# EAGLE design pwr schema (EAGLE 9.6.2)
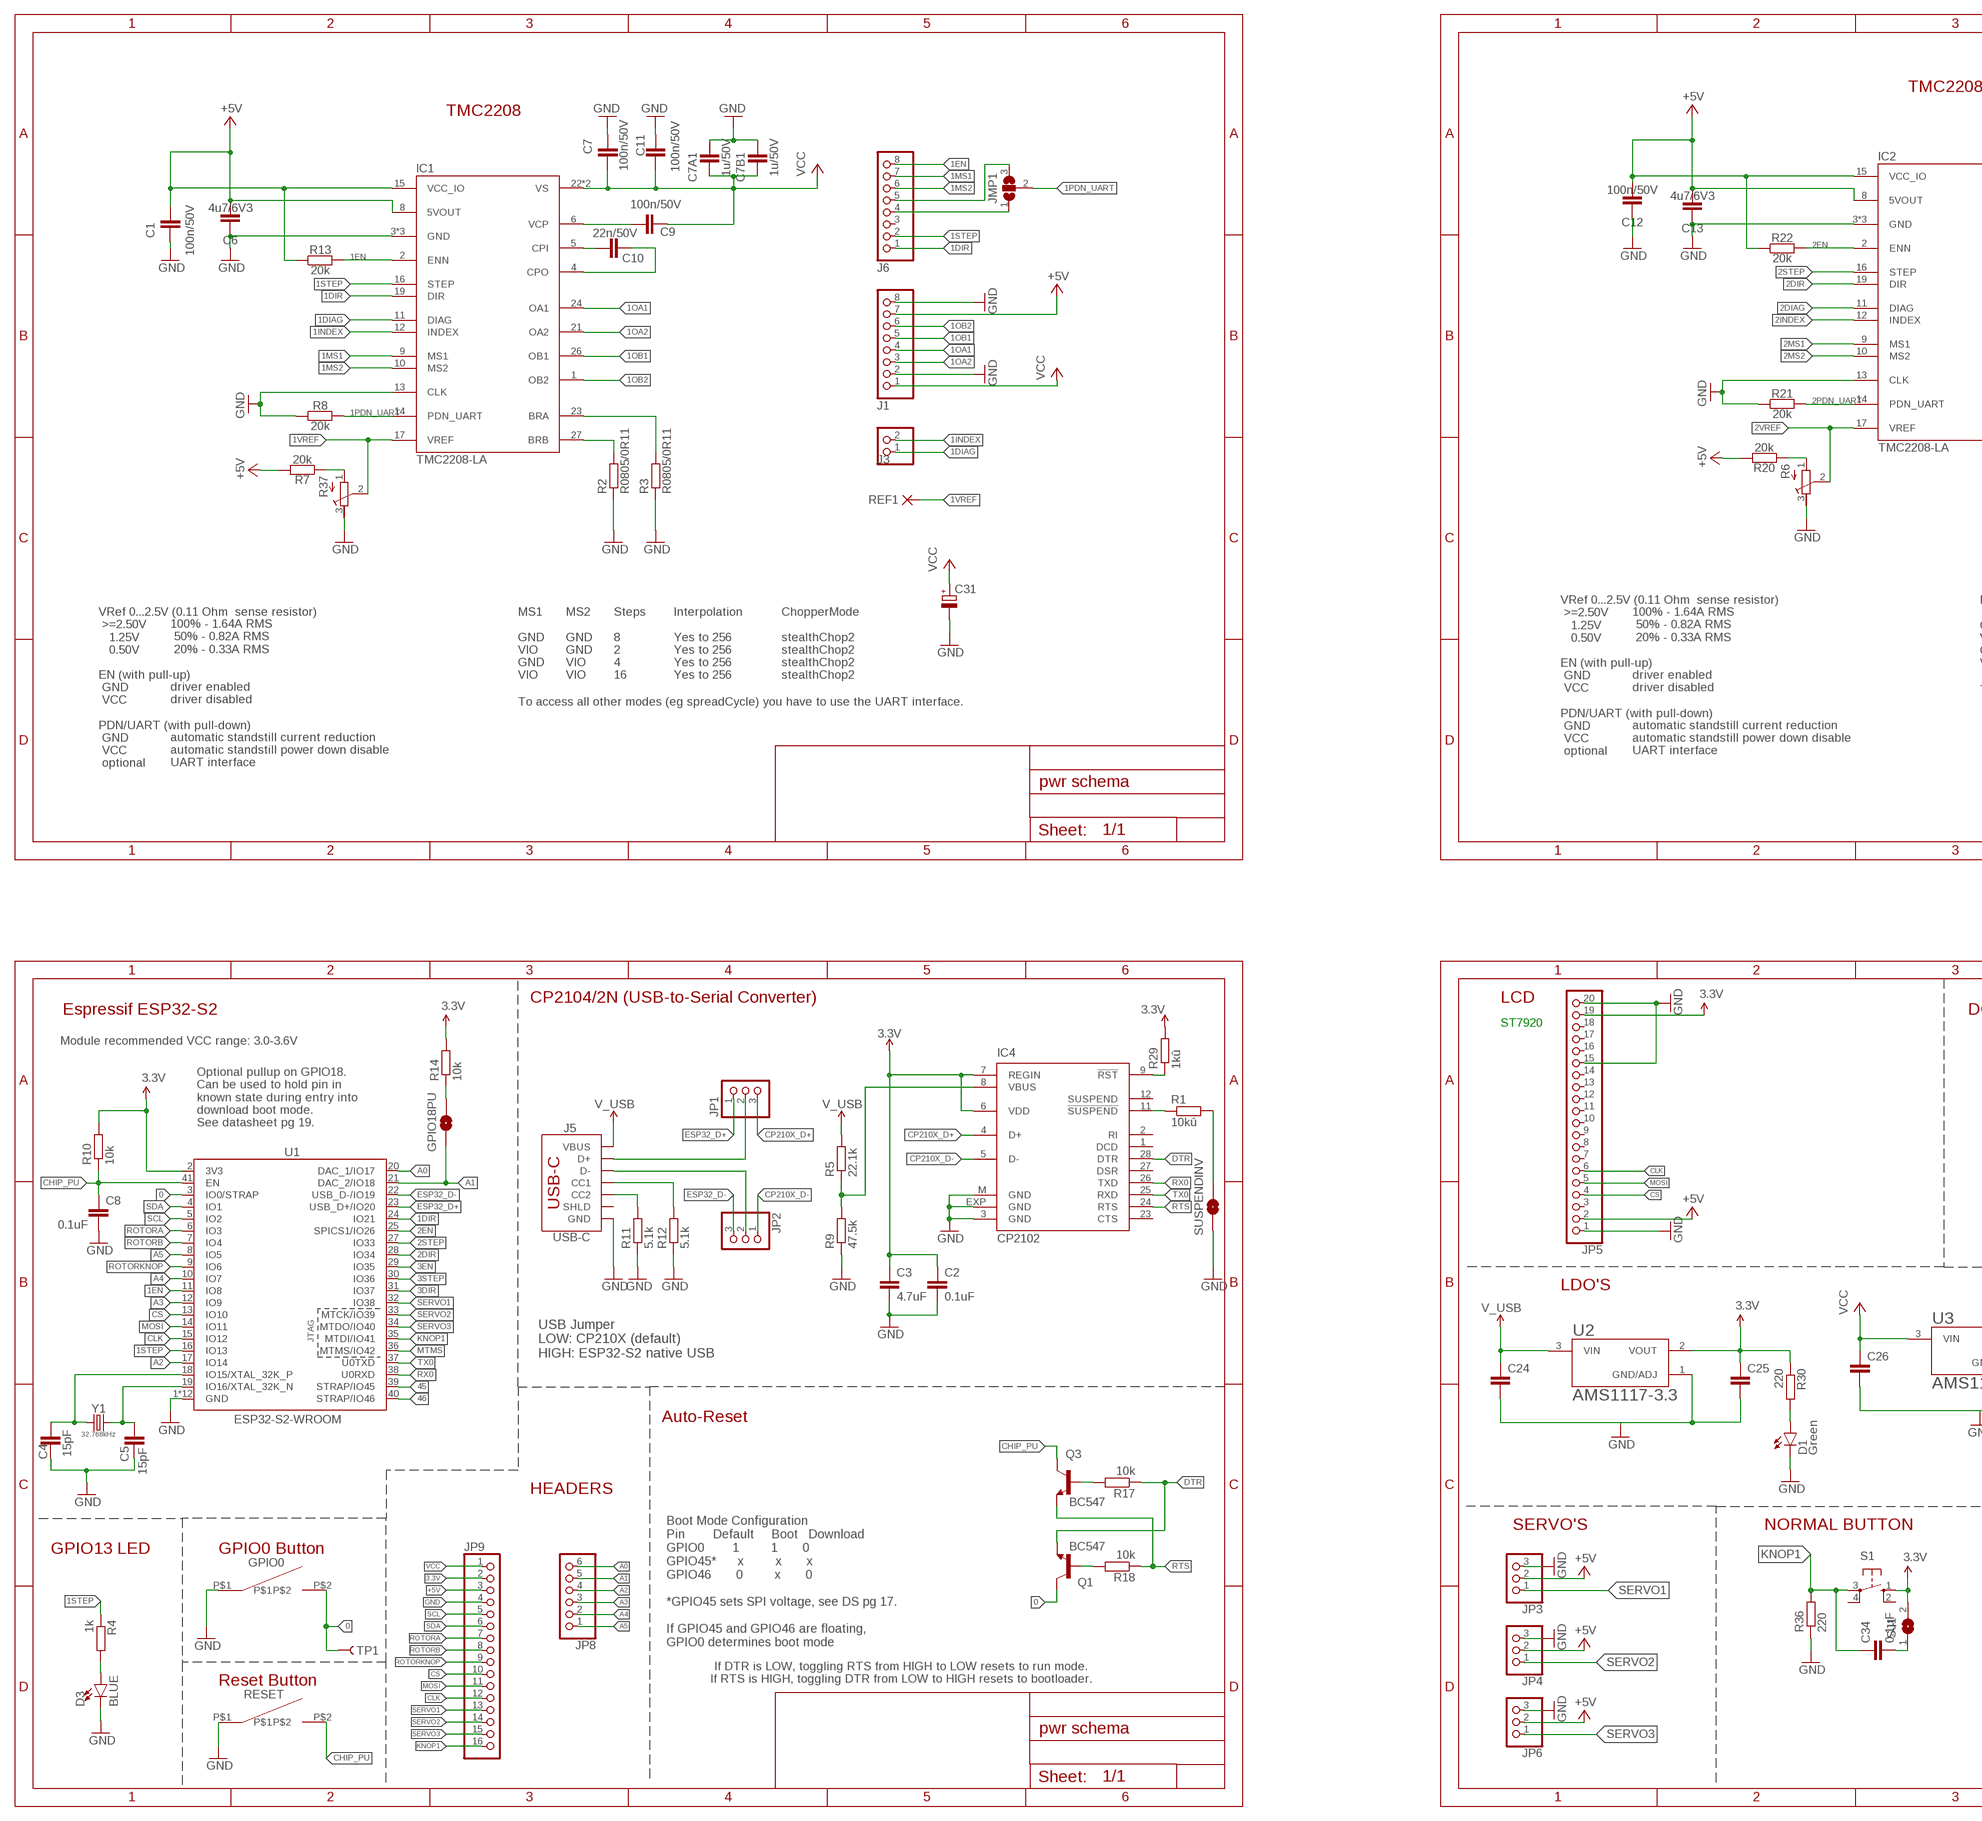
[diagram p0: schematic, sheet 1, part 1 of 2]
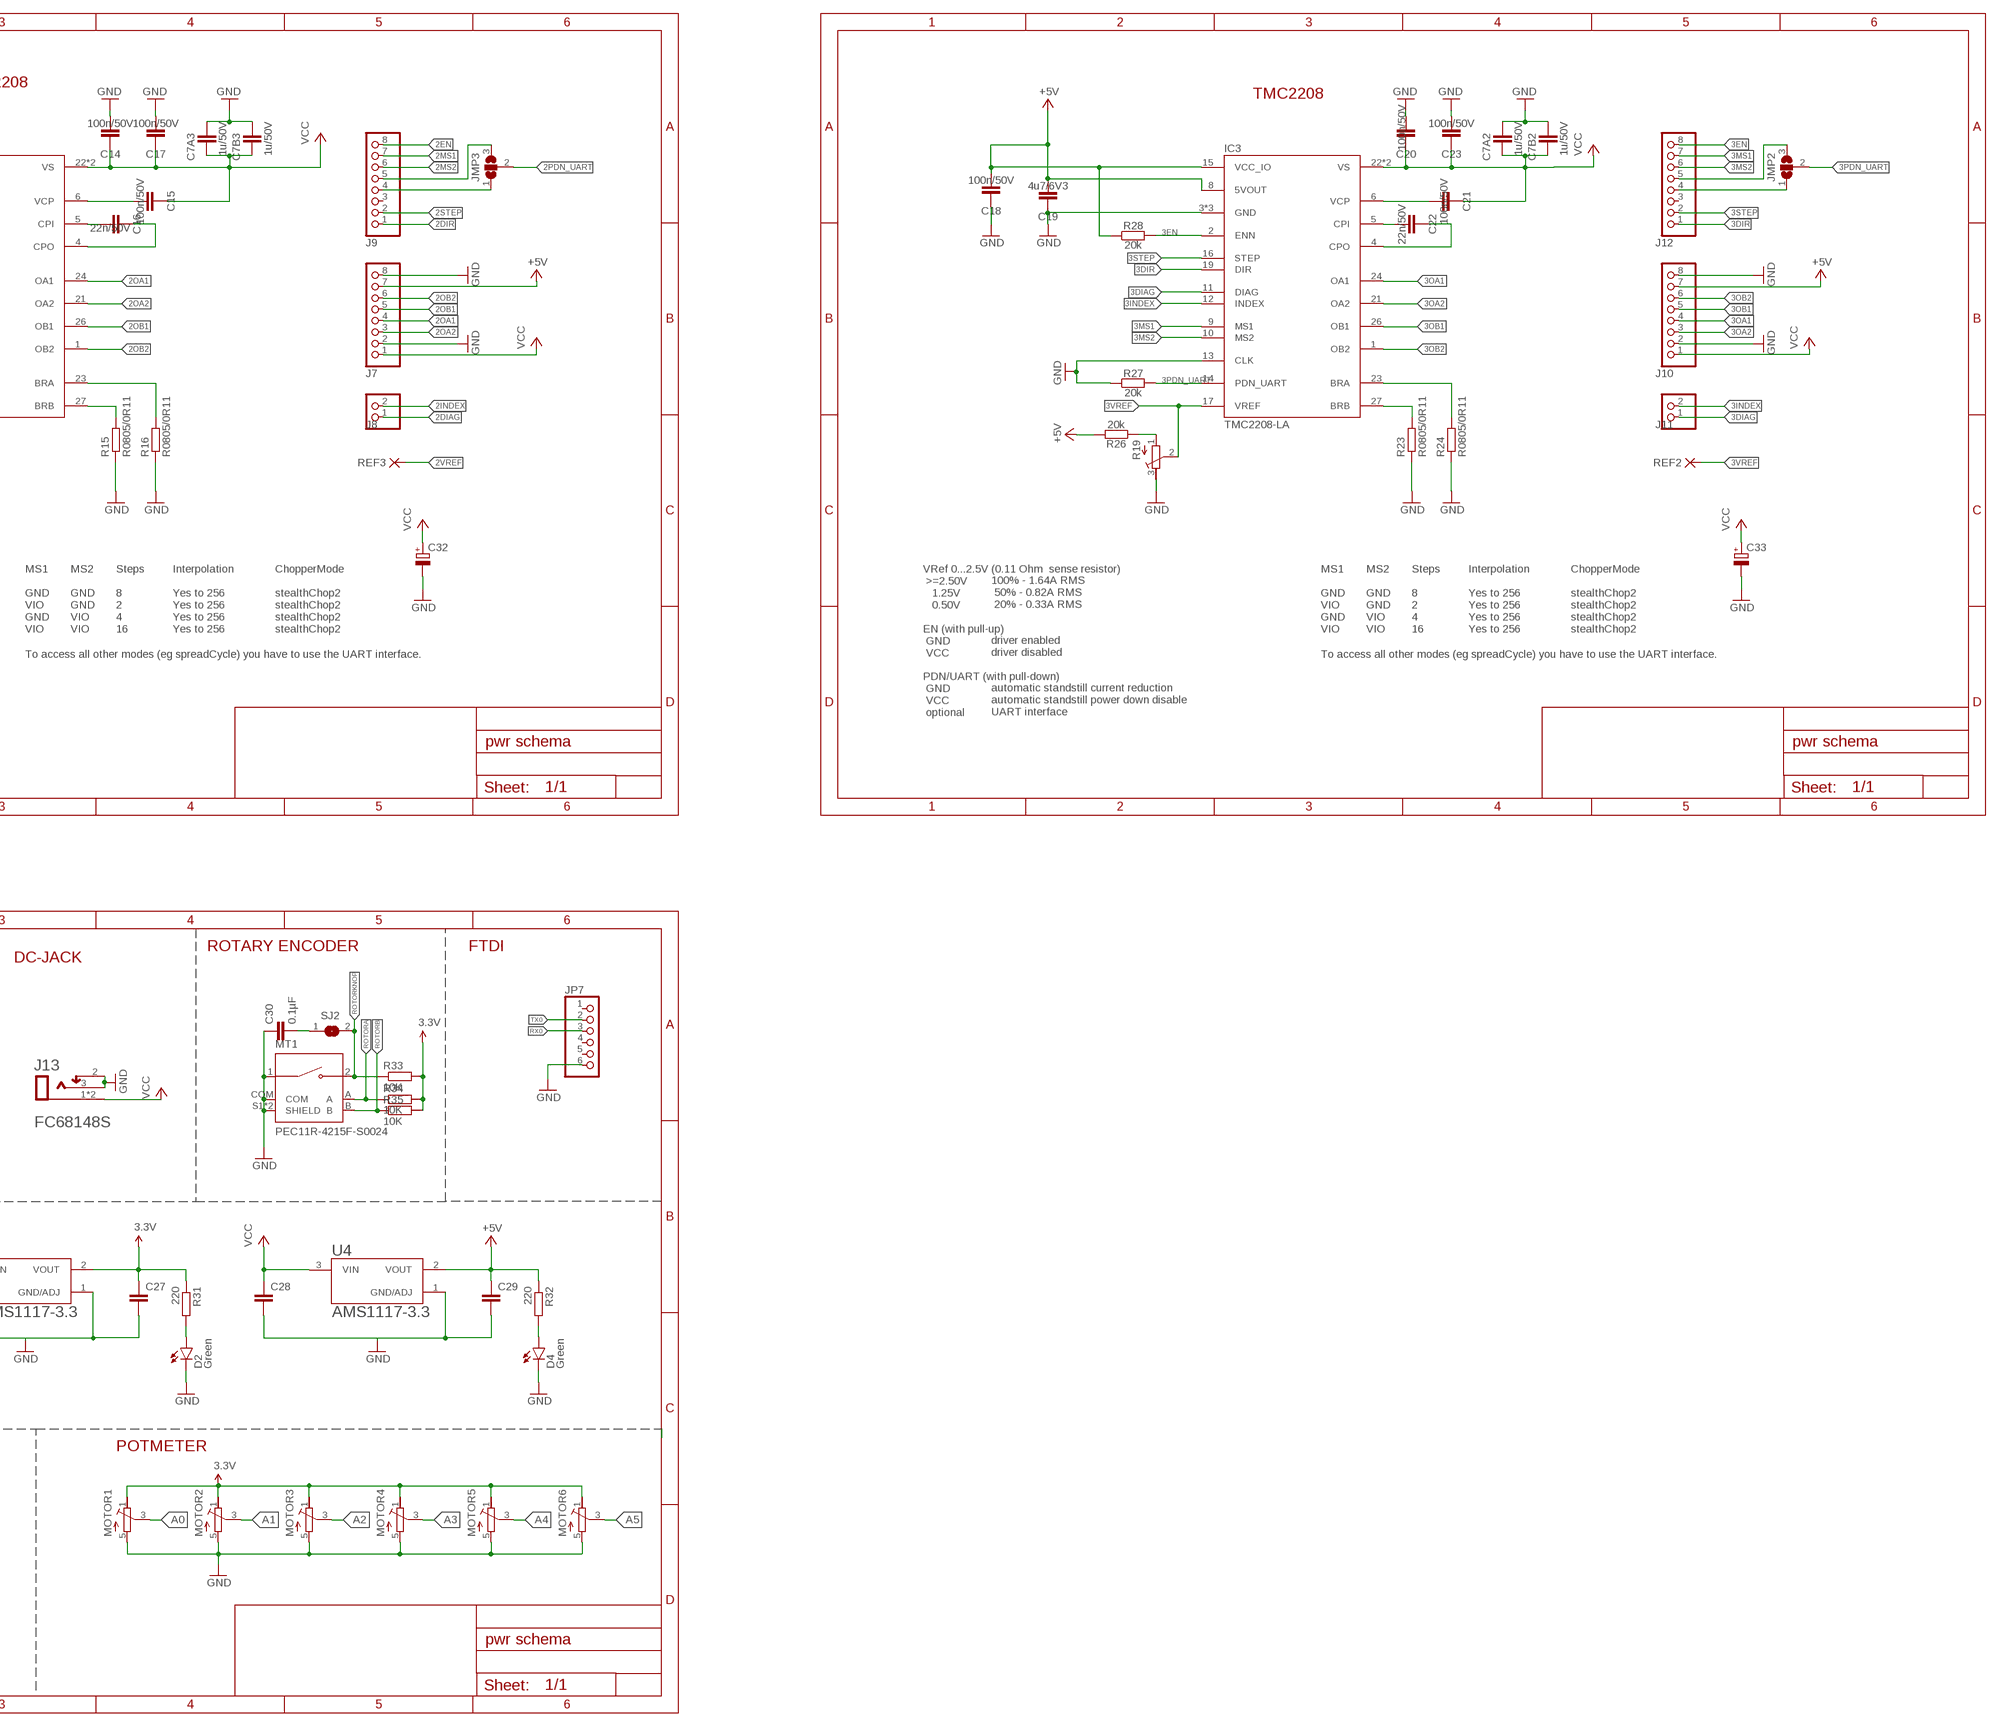
[diagram p1: schematic, sheet 1, part 2 of 2]

## Parts
C1  100n/50V  C-EUC1206  [C1206]
C2  0.1uF  C-EUC1206  [C1206]
C3  4.7uF  C-EUC1206  [C1206]
C4  15pF  C-EUC1206  [C1206]
C5  15pF  C-EUC1206  [C1206]
C6  4u7/6V3  C-EUC1206  [C1206]
C7  100n/50V  C-EUC1206  [C1206]
C7A1  1u/50V  C-EUC1206  [C1206]
C7A2  1u/50V  C-EUC1206  [C1206]
C7A3  1u/50V  C-EUC1206  [C1206]
C7B1  1u/50V  C-EUC1206  [C1206]
C7B2  1u/50V  C-EUC1206  [C1206]
C7B3  1u/50V  C-EUC1206  [C1206]
C8  0.1uF  C-EUC1206  [C1206]
C9  100n/50V  C-EUC1206  [C1206]
C10  22n/50V  C-EUC1206  [C1206]
C11  100n/50V  C-EUC1206  [C1206]
C12  100n/50V  C-EUC1206  [C1206]
C13  4u7/6V3  C-EUC1206  [C1206]
C14  100n/50V  C-EUC1206  [C1206]
C15  100n/50V  C-EUC1206  [C1206]
C16  22n/50V  C-EUC1206  [C1206]
C17  100n/50V  C-EUC1206  [C1206]
C18  100n/50V  C-EUC1206  [C1206]
C19  4u7/6V3  C-EUC1206  [C1206]
C20  100n/50V  C-EUC1206  [C1206]
C21  100n/50V  C-EUC1206  [C1206]
C22  22n/50V  C-EUC1206  [C1206]
C23  100n/50V  C-EUC1206  [C1206]
C24  C-EUC1206  [C1206]
C25  C-EUC1206  [C1206]
C26  C-EUC1206  [C1206]
C27  C-EUC1206  [C1206]
C28  C-EUC1206  [C1206]
C29  C-EUC1206  [C1206]
C30  0.1µF  C-EUC1206  [C1206]
C31  CPOL-EUE2.5-6  [E2,5-6]
C32  CPOL-EUE2.5-6  [E2,5-6]
C33  CPOL-EUE2.5-6  [E2,5-6]
C34  0.1µF  C-EUC1206  [C1206]
D1  Green  LEDCHIP-LED0603  [CHIP-LED0603]
D2  Green  LEDCHIP-LED0603  [CHIP-LED0603]
D3  BLUE  LED-BLUE0603  [LED-0603]
D4  Green  LEDCHIP-LED0603  [CHIP-LED0603]
GPIO0  SWITCHSMD3X6MM  [SWITCHSMD3X6MM]
GPIO18PU  JUMPER-SMT_2_NO_SILK  [SMT-JUMPER_2_NO_SILK]
IC1  TMC2208-LA  [QFN28-PAD]
IC2  TMC2208-LA  [QFN28-PAD]
IC3  TMC2208-LA  [QFN28-PAD]
IC4  CP2102  [MLP28]
J1  PINHD-1X8  [1X08]
J3  PINHD-1X2  [1X02]
J5  USB-C  USB_C_4-LAYER-ISOLATED  [USB-C-16P-4LAYER-ISOLATED]
J6  PINHD-1X8  [1X08]
J7  PINHD-1X8  [1X08]
J8  PINHD-1X2  [1X02]
J9  PINHD-1X8  [1X08]
J10  PINHD-1X8  [1X08]
J11  PINHD-1X2  [1X02]
J12  PINHD-1X8  [1X08]
J13  CLIFF_FC68148SCLIFF_FC68148S_0_0  [CLIFF_FC68148S_0]
JMP1  JUMPER3-0402-NC  [JUMPER3-0402_NC]
JMP2  JUMPER3-0402-NC  [JUMPER3-0402_NC]
JMP3  JUMPER3-0402-NC  [JUMPER3-0402_NC]
JP1  PINHD-1X3  [1X03]
JP2  PINHD-1X3  [1X03]
JP3  PINHD-1X3  [1X03]
JP4  PINHD-1X3  [1X03]
JP5  PINHD-1X20  [1X20]
JP6  PINHD-1X3  [1X03]
JP7  PINHD-1X6  [1X06]
JP8  PINHD-1X6  [1X06]
JP9  PINHD-1X16  [1X16]
MOTOR1  POTMETER  [POTMETER]
MOTOR2  POTMETER  [POTMETER]
MOTOR3  POTMETER  [POTMETER]
MOTOR4  POTMETER  [POTMETER]
MOTOR5  POTMETER  [POTMETER]
MOTOR6  POTMETER  [POTMETER]
MT1  PEC11R-4215F-S0024  [XDCR_PEC11R-4215F-S0024]
Q1  BC547  [TO92]
Q3  BC547  [TO92]
R1  10kû  R-EU_R1206  [R1206]
R2  R0805/0R11  R-EU_R1206  [R1206]
R3  R0805/0R11  R-EU_R1206  [R1206]
R4  1k  R-EU_R1206  [R1206]
R5  22.1k  R-EU_R1206  [R1206]
R6  R-TRIMM3103  [RTRIM3103]
R7  20k  R-EU_R1206  [R1206]
R8  20k  R-EU_R1206  [R1206]
R9  47.5k  R-EU_R1206  [R1206]
R10  10k  R-EU_R1206  [R1206]
R11  5.1k  R-EU_R1206  [R1206]
R12  5.1k  R-EU_R1206  [R1206]
R13  20k  R-EU_R1206  [R1206]
R14  10k  R-EU_R1206  [R1206]
R15  R0805/0R11  R-EU_R1206  [R1206]
R16  R0805/0R11  R-EU_R1206  [R1206]
R17  10k  R-EU_R1206  [R1206]
R18  10k  R-EU_R1206  [R1206]
R19  R-TRIMM3103  [RTRIM3103]
R20  20k  R-EU_R1206  [R1206]
R21  20k  R-EU_R1206  [R1206]
R22  20k  R-EU_R1206  [R1206]
R23  R0805/0R11  R-EU_R1206  [R1206]
R24  R0805/0R11  R-EU_R1206  [R1206]
R26  20k  R-EU_R1206  [R1206]
R27  20k  R-EU_R1206  [R1206]
R28  20k  R-EU_R1206  [R1206]
R29  1kû  R-EU_R1206  [R1206]
R30  220  R-EU_R1206  [R1206]
R31  220  R-EU_R1206  [R1206]
R32  220  R-EU_R1206  [R1206]
R33  10K  R-EU_R1206  [R1206]
R34  10K  R-EU_R1206  [R1206]
R35  10K  R-EU_R1206  [R1206]
R36  220  R-EU_R1206  [R1206]
R37  R-TRIMM3103  [RTRIM3103]
REF1  PAD-0.6-1.1  [PAD-0.6-1.1]
REF2  PAD-0.6-1.1  [PAD-0.6-1.1]
REF3  PAD-0.6-1.1  [PAD-0.6-1.1]
RESET  SWITCHSMD3X6MM  [SWITCHSMD3X6MM]
S1  10-XX  [B3F-10XX]
SJ1  SJ  [SJ]
SJ2  SJ  [SJ]
SUSPENDINV  JUMPER-SMT_2_NO_SILK  [SMT-JUMPER_2_NO_SILK]
TP1  TEST-POINTTP_15TH_THRU  [TP_15TH]
U1  ESP32-S2-WROOM  [ESP32-S2-WROOM]
U2  AMS1117-3.3  [SOT229P700X180-4N]
U3  AMS1117-3.3  [SOT229P700X180-4N]
U4  AMS1117-3.3  [SOT229P700X180-4N]
Y1  32.768kHz  CRYSTAL-32.768KHZSMD-3.2X1.5  [CRYSTAL-SMD-3.2X1.5MM]

## Nets
0: GPIO0.P$2 Q1.3(C) TP1.P$1 U1.3(IO0/STRAP)
1BRA: IC1.23(BRA) R3.2
1BRB: IC1.27(BRB) R2.2
1CPI: C10.2 IC1.5(CPI)
1CPO: C10.1 IC1.4(CPO)
1DIAG: IC1.11(DIAG) J3.1
1DIR: IC1.19(DIR) J6.1 U1.24(IO21)
1EN: IC1.2(ENN) J6.8 R13.2 U1.11(IO8)
1INDEX: IC1.12(INDEX) J3.2
1MS1: IC1.9(MS1) J6.7
1MS2: IC1.10(MS2) J6.6
1OA1: IC1.24(OA1) J1.4
1OA2: IC1.21(OA2) J1.3
1OB1: IC1.26(OB1) J1.5
1OB2: IC1.1(OB2) J1.6
1PDN_UART: IC1.14(PDN_UART) JMP1.2 R8.2
1STEP: IC1.16(STEP) J6.2 R4.1 U1.16(IO13)
1VCP: C9.2 IC1.6(VCP)
1VREF: IC1.17(VREF) R37.2(S) REF1.1(P)
1VREF1: R7.1 R37.1(A)
2BRA: IC2.23(BRA) R16.2
2BRB: IC2.27(BRB) R15.2
2CPI: C16.2 IC2.5(CPI)
2CPO: C16.1 IC2.4(CPO)
2DIAG: IC2.11(DIAG) J8.1
2DIR: IC2.19(DIR) J9.1 U1.28(IO34)
2EN: IC2.2(ENN) J9.8 R22.2 U1.25(SPICS1/IO26)
2INDEX: IC2.12(INDEX) J8.2
2MS1: IC2.9(MS1) J9.7
2MS2: IC2.10(MS2) J9.6
2OA1: IC2.24(OA1) J7.4
2OA2: IC2.21(OA2) J7.3
2OB1: IC2.26(OB1) J7.5
2OB2: IC2.1(OB2) J7.6
2PDN_UART: IC2.14(PDN_UART) JMP3.2 R21.2
2STEP: IC2.16(STEP) J9.2 U1.27(IO33)
2VCP: C15.2 IC2.6(VCP)
2VREF: IC2.17(VREF) R6.2(S) REF3.1(P)
2VREF1: R6.1(A) R20.1
3.3V: C2.1 C3.1 C25.1 C27.1 IC4.6(VDD) IC4.7(REGIN) JP5.19 JP9.2 MOTOR1.1(E) MOTOR2.1(E) MOTOR3.1(E) MOTOR4.1(E) MOTOR5.1(E) MOTOR6.1(E) R10.2 R14.2 R29.2 R30.1 R31.1 R33.2 R34.2 R35.2 S1.1(S) SJ1.2 U1.2(3V3) U2.2(VOUT) U3.2(VOUT)
3BRA: IC3.23(BRA) R24.2
3BRB: IC3.27(BRB) R23.2
3CPI: C22.2 IC3.5(CPI)
3CPO: C22.1 IC3.4(CPO)
3DIAG: IC3.11(DIAG) J11.1
3DIR: IC3.19(DIR) J12.1 U1.31(IO37)
3EN: IC3.2(ENN) J12.8 R28.2 U1.29(IO35)
3INDEX: IC3.12(INDEX) J11.2
3MS1: IC3.9(MS1) J12.7
3MS2: IC3.10(MS2) J12.6
3OA1: IC3.24(OA1) J10.4
3OA2: IC3.21(OA2) J10.3
3OB1: IC3.26(OB1) J10.5
3OB2: IC3.1(OB2) J10.6
3PDN_UART: IC3.14(PDN_UART) JMP2.2 R27.2
3STEP: IC3.16(STEP) J12.2 U1.30(IO36)
3VCP: C21.2 IC3.6(VCP)
3VREF: IC3.17(VREF) R19.2(S) REF2.1(P)
3VREF1: R19.1(A) R26.1
45: U1.39(STRAP/IO45)
46: U1.40(STRAP/IO46)
+5V: C1.2 C6.2 C12.2 C13.2 C18.2 C19.2 C29.1 IC1.8(5VOUT) IC1.15(VCC_IO) IC2.8(5VOUT) IC2.15(VCC_IO) IC3.8(5VOUT) IC3.15(VCC_IO) J1.7 J7.7 J10.7 JP3.2 JP4.2 JP5.2 JP6.2 JP9.3 R7.2 R13.1 R20.2 R22.1 R26.2 R28.1 R32.1 U4.2(VOUT)
A0: JP8.6 MOTOR1.3(S) U1.20(DAC_1/IO17)
A1: GPIO18PU.1 JP8.5 MOTOR2.3(S) U1.21(DAC_2/IO18)
A2: JP8.4 MOTOR3.3(S) U1.17(IO14)
A3: JP8.3 MOTOR4.3(S) U1.12(IO9)
A4: JP8.2 MOTOR5.3(S) U1.10(IO7)
A5: JP8.1 MOTOR6.3(S) U1.8(IO5)
CC1: J5.A5(CC1) R12.2
CC2: J5.B5(CC2) R11.2
CHIP_PU: C8.1 Q3.3(C) R10.1 RESET.P$2 U1.41(EN)
CLK: JP5.6 JP9.12 U1.15(IO12)
CP210X_D+: IC4.4(D+) JP1.3
CP210X_D-: IC4.5(D-) JP2.1
CS: JP5.4 JP9.10 U1.13(IO10)
DTR: IC4.28(DTR) Q1.1(E) R17.1
ESP32_D+: JP1.1 U1.23(USB_D+/IO20)
ESP32_D-: JP2.3 U1.22(USB_D-/IO19)
GND: C1.1 C2.2 C3.2 C4.1 C5.1 C6.1 C7.2 C7A1.2 C7A2.2 C7A3.2 C7B1.2 C7B2.2 C7B3.2 C8.2 C11.2 C12.1 C13.1 C14.2 C17.2 C18.1 C19.1 C20.2 C23.2 C24.2 C25.2 C26.2 C27.2 C28.2 C29.2 C30.1 C31.- C32.- C33.- D1.C D2.C D3.C D4.C GPIO0.P$1 IC1.3(GND) IC1.13(CLK) IC1.18(GND) IC1.TP(GND) IC2.3(GND) IC2.13(CLK) IC2.18(GND) IC2.TP(GND) IC3.3(GND) IC3.13(CLK) IC3.18(GND) IC3.TP(GND) IC4.3(GND) IC4.EXP(GND) IC4.M(GND) J1.2 J1.8 J5.GND J5.GND2(GND) J7.2 J7.8 J10.2 J10.8 J13.2 J13.3 JP3.3 JP4.3 JP5.1 JP5.15 JP5.20 JP6.3 JP7.6 JP9.4 MOTOR1.5(A) MOTOR2.5(A) MOTOR3.5(A) MOTOR4.5(A) MOTOR5.5(A) MOTOR6.5(A) MT1.1 MT1.COM MT1.S1(SHIELD) MT1.S2(SHIELD) R2.1 R3.1 R6.3(E) R8.1 R9.1 R11.1 R12.1 R15.1 R16.1 R19.3(E) R21.1 R23.1 R24.1 R27.1 R36.1 R37.3(E) RESET.P$1 SUSPENDINV.1 U1.1(GND) U1.26(GND) U1.42(GND) U1.GNDEP0(GND) U1.GNDEP1(GND) U1.GNDEP2(GND) U1.GNDEP3(GND) U1.GNDEP4(GND) U1.GNDEP5(GND) U1.GNDEP6(GND) U1.GNDEP7(GND) U1.GNDEP8(GND) U2.1(GND/ADJ) U3.1(GND/ADJ) U4.1(GND/ADJ)
KNOP1: C34.1 JP9.16 R36.2 S1.3(P) U1.35(MTDI/IO41)
MOSI: JP5.5 JP9.11 U1.14(IO11)
MTMS: U1.36(MTMS/IO42)
N$1: IC4.11(!SUSPEND) R1.1
N$2: D3.A R4.2
N$3: J5.A6(D+) J5.B6(D+) JP1.2
N$4: IC4.8(VBUS) R5.1 R9.2
N$5: J5.A7(D-) J5.B7(D-) JP2.2
N$7: C4.2 U1.18(IO15/XTAL_32K_P) Y1.P$1
N$8: C5.2 U1.19(IO16/XTAL_32K_N) Y1.P$2
N$9: J6.4 JMP1.1
N$10: Q3.2(B) R17.2
N$11: J6.5 JMP1.3
N$12: Q1.2(B) R18.2
N$13: J9.4 JMP3.1
N$14: GPIO18PU.2 R14.1
N$15: J9.5 JMP3.3
N$16: J12.4 JMP2.1
N$17: J12.5 JMP2.3
N$19: IC4.9(!RST) R29.1
N$20: R1.2 SUSPENDINV.2
N$21: D1.A R30.2
N$22: D2.A R31.2
N$23: D4.A R32.2
NCKNOP: C34.2 SJ1.1
NCROTORY: C30.2 SJ2.1
ROTORA: JP9.7 MT1.A R34.1 U1.6(IO3)
ROTORB: JP9.8 MT1.B R35.1 U1.7(IO4)
ROTORKNOP: JP9.9 MT1.2 R33.1 SJ2.2 U1.9(IO6)
RTS: IC4.24(RTS) Q3.1(E) R18.1
RX0: IC4.26(TXD) JP7.3 U1.38(U0RXD)
SCL: JP9.5 U1.5(IO2)
SDA: JP9.6 U1.4(IO1)
SERVO1: JP3.1 JP9.13 U1.32(IO38)
SERVO2: JP4.1 JP9.14 U1.33(MTCK/IO39)
SERVO3: JP6.1 JP9.15 U1.34(MTDO/IO40)
TX0: IC4.25(RXD) JP7.2 U1.37(U0TXD)
V_USB: C24.1 J5.VBUS1(VBUS) J5.VBUS2(VBUS) R5.2 U2.3(VIN)
VCC: C7.1 C7A1.1 C7A2.1 C7A3.1 C7B1.1 C7B2.1 C7B3.1 C9.1 C11.1 C14.1 C15.1 C17.1 C20.1 C21.1 C23.1 C26.1 C28.1 C31.+ C32.+ C33.+ IC1.22(VS) IC1.28(VS) IC2.22(VS) IC2.28(VS) IC3.22(VS) IC3.28(VS) J1.1 J7.1 J10.1 J13.1 J13.1-2 JP9.1 U3.3(VIN) U4.3(VIN)
Unconnected: IC4.1(DCD) IC4.2(RI) IC4.12(SUSPEND) IC4.23(CTS) IC4.27(DSR) J5.SHLD1(SHLD) J5.SHLD2(SHLD) J5.SHLD3(SHLD) J5.SHLD4(SHLD) J5.SHLD5(SHLD) J5.SHLD6(SHLD) J5.SHLD7(SHLD) J5.SHLD8(SHLD) J6.3 J9.3 J12.3 JP5.3 JP5.7 JP5.8 JP5.9 JP5.10 JP5.11 JP5.12 JP5.13 JP5.14 JP5.16 JP5.17 JP5.18 JP7.1 JP7.4 JP7.5 S1.2(S1) S1.4(P1)

## Notes on the sheet
- TMC2208
- TMC2208
- TMC2208
- VRef 0...2.5V (0.11 Ohm  sense resistor)
   >=2.50V
     1.25V
     0.50V
  
  EN (with pull-up)
   GND
   VCC
  
  PDN/UART (with pull-down)
   GND
   VCC
   optional
- MS1
  
  GND
  VIO
  GND
  VIO
- MS2
  
  GND
  GND
  VIO
  VIO
- Steps
  
  8
  2
  4
  16
- Interpolation
  
  Yes to 256
  Yes to 256
  Yes to 256
  Yes to 256
- ChopperMode
  
  stealthChop2
  stealthChop2
  stealthChop2
  stealthChop2
- VRef 0...2.5V (0.11 Ohm  sense resistor)
   >=2.50V
     1.25V
     0.50V
  
  EN (with pull-up)
   GND
   VCC
  
  PDN/UART (with pull-down)
   GND
   VCC
   optional
- MS1
  
  GND
  VIO
  GND
  VIO
- MS2
  
  GND
  GND
  VIO
  VIO
- Steps
  
  8
  2
  4
  16
- Interpolation
  
  Yes to 256
  Yes to 256
  Yes to 256
  Yes to 256
- ChopperMode
  
  stealthChop2
  stealthChop2
  stealthChop2
  stealthChop2
- VRef 0...2.5V (0.11 Ohm  sense resistor)
   >=2.50V
     1.25V
     0.50V
  
  EN (with pull-up)
   GND
   VCC
  
  PDN/UART (with pull-down)
   GND
   VCC
   optional
- MS1
  
  GND
  VIO
  GND
  VIO
- MS2
  
  GND
  GND
  VIO
  VIO
- Steps
  
  8
  2
  4
  16
- Interpolation
  
  Yes to 256
  Yes to 256
  Yes to 256
  Yes to 256
- ChopperMode
  
  stealthChop2
  stealthChop2
  stealthChop2
  stealthChop2
- 100% - 1.64A RMS
   50% - 0.82A RMS
   20% - 0.33A RMS
  
  
  driver enabled
  driver disabled
  
  
  automatic standstill current reduction
  automatic standstill power down disable
  UART interface
- 100% - 1.64A RMS
   50% - 0.82A RMS
   20% - 0.33A RMS
  
  
  driver enabled
  driver disabled
  
  
  automatic standstill current reduction
  automatic standstill power down disable
  UART interface
- 100% - 1.64A RMS
   50% - 0.82A RMS
   20% - 0.33A RMS
  
  
  driver enabled
  driver disabled
  
  
  automatic standstill current reduction
  automatic standstill power down disable
  UART interface
- To access all other modes (eg spreadCycle) you have to use the UART interface. | To access all other modes (eg spreadCycle) you have to use the UART interface.
- To access all other modes (eg spreadCycle) you have to use the UART interface.
- CP2104/2N (USB-to-Serial Converter) | LCD | ROTARY ENCODER | FTDI
- Espressif ESP32-S2 | DC-JACK
- ST7920
- Module recommended VCC range: 3.0-3.6V
- Optional pullup on GPIO18.
  Can be used to hold pin in 
  known state during entry into
  download boot mode. 
  See datasheet pg 19.
- LDO'S
- USB Jumper
  LOW: CP210X (default)
  HIGH: ESP32-S2 native USB
- Auto-Reset
- HEADERS
- SERVO'S | NORMAL BUTTON | POTMETER
- GPIO13 LED | GPIO0 Button
- Boot Mode Configuration
  Pin        Default     Boot   Download
  GPIO0        1         1       0
  GPIO45*      x         x       x 
  GPIO46       0         x       0
  
  *GPIO45 sets SPI voltage, see DS pg 17.
  
  If GPIO45 and GPIO46 are floating, 
  GPIO0 determines boot mode
- If DTR is LOW, toggling RTS from HIGH to LOW resets to run mode.
  If RTS is HIGH, toggling DTR from LOW to HIGH resets to bootloader.
- Reset Button

## Library data of the parts
C1-C7 C7A1-C7A3 C7B1-C7B3 C8-C30 C34 = rcl:C-EU: CAPACITOR, European symbol; SPICEPREFIX: C
C31-C33 = rcl:CPOL-EU: POLARIZED CAPACITOR, European symbol; SPICEPREFIX: C
D1 D2 D4 = led:LED: LED OSRAM: - CHIPLED LG R971, LG N971, LY N971, LG Q971, LY Q971, LO R971, LY R971 LH N974, LH R974 LS Q976, LO Q976, LY Q976 LO Q996 - Hyper CHIPLED LW Q18S LB Q993, LB Q99A, LB R99A - SideLED LS A670, LO A670, LY A670, LG A670, LP A670 LB A673, LV A673, LT A673, LW A673 LH A674 LY A675 LS A676, LA A676, LO A676, LY A676, LW A676 LS A679, LY A679, LG A679 - Hyper Micro SIDELED® LS Y876, LA Y876, LO Y876, LY Y876 LT Y87S - SmartLED LW L88C, LW L88S LB L89C, LB L89S, LG L890 LS L89K, LO L89K, LY L89K LS L896, LA L896, LO L896, LY L896 - TOPLED LS T670, LO T670, LY T670, LG T670, LP T670 LSG T670, LSP T670, LSY T670, LOP T670, LYG T670 LG T671, LOG T671, LSG T671 LB T673, LV T673, LT T673, LW T673 LH T674 LS T676, LA T676, LO T676, LY T676, LB T676, LH T676, LSB T676, LW T676 LB T67C, LV T67C, LT T67C, LS T67K, LO T67K, LY T67K, LW E67C LS E67B, LA E67B, LO E67B, LY E67B, LB E67C, LV E67C, LT E67C LW T67C LS T679, LY T679, LG T679 LS T770, LO T770, LY T770, LG T770, LP T770 LB T773, LV T773, LT T773, LW T773 LH T774 LS E675, LA E675, LY E675, LS T675 LS T776, LA T776, LO T776, LY T776, LB T776 LHGB T686 LT T68C, LB T68C - Hyper Mini TOPLED® LB M676 - Mini TOPLED Santana® LG M470 LS M47K, LO M47K, LY M47K Source: http://www.osram.convergy.de LUXEON: - LUMILED® LXK2-PW12-R00, LXK2-PW12-S00, LXK2-PW14-U00, LXK2-PW14-V00 LXK2-PM12-R00, LXK2-PM12-S00, LXK2-PM14-U00 LXK2-PE12-Q00, LXK2-PE12-R00, LXK2-PE12-S00, LXK2-PE14-T00, LXK2-PE14-U00 LXK2-PB12-K00, LXK2-PB12-L00, LXK2-PB12-M00, LXK2-PB14-N00, LXK2-PB14-P00, LXK2-PB14-Q00 LXK2-PR12-L00, LXK2-PR12-M00, LXK2-PR14-Q00, LXK2-PR14-R00 LXK2-PD12-Q00, LXK2-PD12-R00, LXK2-PD12-S00 LXK2-PH12-R00, LXK2-PH12-S00 LXK2-PL12-P00, LXK2-PL12-Q00, LXK2-PL12-R00 Source: www.luxeon.com KINGBRIGHT: KA-3528ASYC Source: www.kingbright.com
D3 = SparkFun-LED:LED-BLUE: Blue SMD LED Used in manufacturing of various products at SparkFun Packages: 0603 - SMD 0603 package [Product Link] <http://www.digikey.com/product-detail/en/SMLE12BC7TT86/511-1589-2-ND/1641808> 1206 - SMD1206 package [Product Link] <http://www.digikey.com/product-detail/en/lite-on-inc/LTST-C150TBKT/160-1643-1-ND/573584> SparkFun Products: ESP8266 Thing-Dev Board <https://www.sparkfun.com/products/13711> RedBoard <https://www.sparkfun.com/products/12757>; PROD_ID: DIO-08575
GPIO0 RESET = switchsmd3x6mm:SWITCHSMD3X6MM
GPIO18PU SUSPENDINV = SparkFun-Jumpers:JUMPER-SMT_2_NO: Normally open jumper This jumper has two pads in close proximity to each other. Apply solder to close the connection. Round pads are easier to solder for beginners, but are a lot larger. SparkFun Product that uses the round pads: SparkFun EL Sequencer <https://www.sparkfun.com/products/12781>
IC1-IC3 = we-chip:TMC2208: Trinamic TMC2208 Stepper Motor Driver (5V...36V, 1.2A RMS, 256 microsteps)
IC4 = silabs:CP210*: Single-Chip USB to UART Bridge Source: www.silabs.com .. CP2101.pdf / cp2102.pdf; MF: FARNELL; MPN: CP2102-GM; OC_FARNELL: 9282130; OC_NEWARK: 30K5635
J1 J6 J7 J9 J10 J12 = pinhead:PINHD-1X8: PIN HEADER
J3 J8 J11 = pinhead:PINHD-1X2: PIN HEADER
J5 = SparkFun-Connectors:USB_C: USB Type C 16Pin Connector Super Speed pins not available on the 16-pin purely SMD connector so this part is best for USB 2.0 implementations. D1 and D2 are tied together enabling D+/- no matter which way the cable is plugged into the connector. The two channel configuration pins (CC1/2) are exposed. These are normally connected to ground via 5.1k resistors but can be reconfigured for high current/high power applications. **4-LAYER BOARD WARNING!!** If designing 4-layer board, make sure to select the variant _4-LAYER-ISOLATED. The linked footprint (USB-C-16-4LAYER-ISOLATED) includes some very necessary cutout polygons in the inner layers (2 and 15). This prevents the PTH mounting shield legs on the USB connector from electrically connecting any other polygons on the inner layers (usually VCC and GND).; PROD_ID: CONN-14122; VALUE: USB Female Type C Connector
J13 = Cliff - FC68148S:CLIFF_FC68148S: SMD SOCKET DC-10AS 2.1mm +DC-10BS 2.5mm; CENTROID_NOT_SPECIFIED: No; DATASHEET: http://www.cliffuk.co.uk/products/dcconnectors/FC68148S.pdf; LEAD_FREE: yes; MF: Cliff; MPN: FC68148S; PACKAGE: SMT_CONN_8MM9_14MM7; PREFIX: J; ROHS: yes
JMP1-JMP3 = we-rcl:JUMPER3: 3-Pin Jumper
JP1-JP4 JP6 = pinhead:PINHD-1X3: PIN HEADER
JP5 = pinhead:PINHD-1X20: PIN HEADER
JP7 JP8 = pinhead:PINHD-1X6: PIN HEADER
JP9 = pinhead:PINHD-1X16: PIN HEADER
MOTOR1-MOTOR6 = POTMETER:POTMETER
MT1 = PEC11R-4215F-S0024:PEC11R-4215F-S0024: Incremental Encoder, 12 Mm, Contact Rating 10 Ma - 5 Vdc Check availability <https://pricing.snapeda.com/parts/PEC11R-4215F-S0024/Bourns/view-part?ref=eda>; AVAILABILITY: In Stock; DESCRIPTION: Rotary Encoder Mechanical 24 Quadrature (Incremental) Vertical; MF: Bourns; MP: PEC11R-4215F-S0024; PACKAGE: None; PRICE: None; PURCHASE-URL: https://pricing.snapeda.com/search/part/PEC11R-4215F-S0024/?ref=eda
Q1 Q3 = transistor-npn:BC547*: NPN Transistor
R1-R5 R7-R18 R20-R24 R26-R36 = rcl:R-EU_: RESISTOR, European symbol; SPICEPREFIX: R
R6 R19 R37 = rcl:R-TRIMM: Trimm resistor; SPICEMODEL: X; SPICEPREFIXL: POT
REF1-REF3 = we-rcl:PAD: Pad / Test-Point
S1 = switch-omron:10-XX: OMRON SWITCH; MPN: B3F-1000; OC_FARNELL: 176432; OC_NEWARK: 36M3542
SJ1 SJ2 = jumper:SJ: SMD solder JUMPER
TP1 = SparkFun-Connectors:TEST-POINT: SparkFun Test Points Bare copper test points for troubleshooting or In-Circuit-Testing. These are used by our Production team for verifying production board runs using pogo-pins on test beds. SparkFun Products: SparkFun LSM9DS1 Breakout <https://www.sparkfun.com/products/13284> SparkFun PSOC <https://www.sparkfun.com/products/13714> SparkFun Load Cell Amplifier <https://www.sparkfun.com/products/13879>
U1 = esp32-s2-wroom:ESP32-S2-WROOM: ESP32-S2-WROOM - trace antenna (includes keepout); PROD_ID: IC-15599
U2-U4 = AMS1117-3.3:AMS1117-3.3: Check availability <https://pricing.snapeda.com/parts/AMS1117-3.3/Advanced%20Monolithic%20Systems/view-part?ref=eda>; AVAILABILITY: Not in stock; DESCRIPTION: Sot223/Pkg 1-Amp 3.3-Volt Low Drop Out Voltage Regulatator; MF: Advanced Monolithic Systems; MP: AMS1117-3.3; PACKAGE: SOT-223 Seeed Technology; PRICE: None
Y1 = SparkFun-Clocks:CRYSTAL-32.768KHZ: 32.768kHz Crystal Frequency: 32.768kHz Frequency Stability: ±20ppm Load Capacitance: 12.5pF (PTH-2X6 & SMD-3.2X1.5), 6pF (SMD-2X6) SparkFun Products: SparkFun BigTime Watch Kit <https://www.sparkfun.com/products/11734> SparkFun nRF52832 Breakout <https://www.sparkfun.com/products/13990> SparkFun Real Time Clock Module <https://www.sparkfun.com/products/12708>; PROD_ID: XTAL-13062

## Board
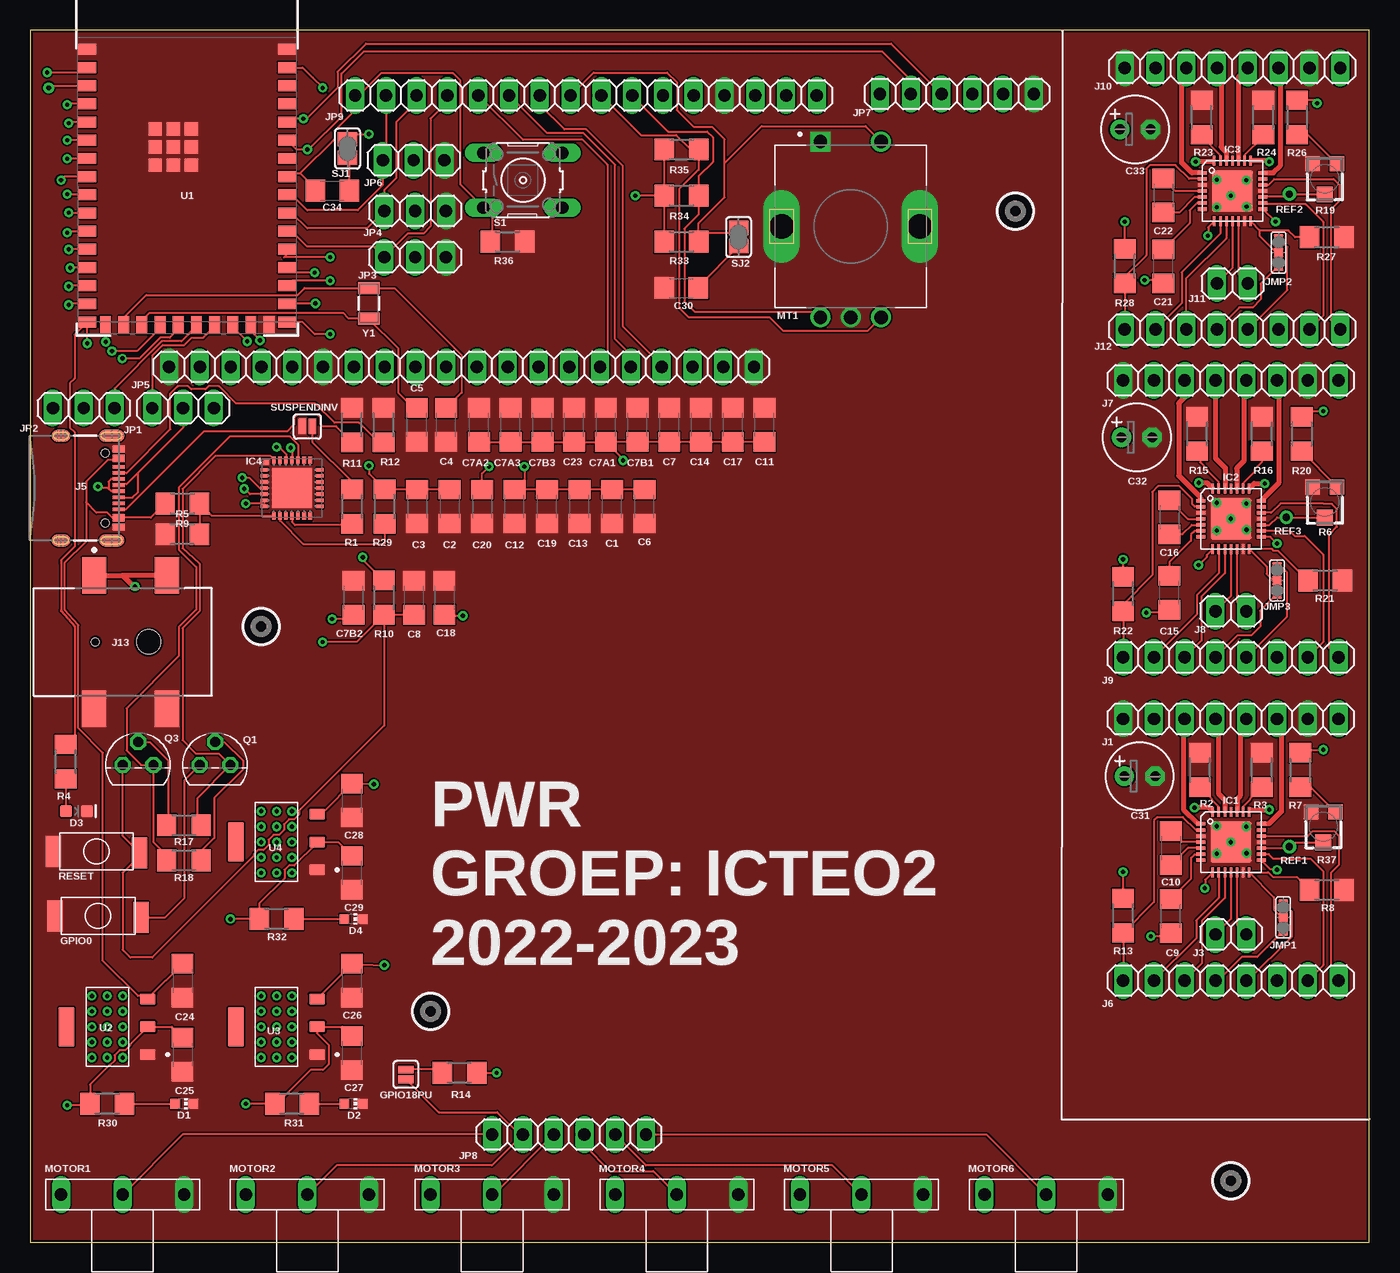
[diagram p2: board, top side]
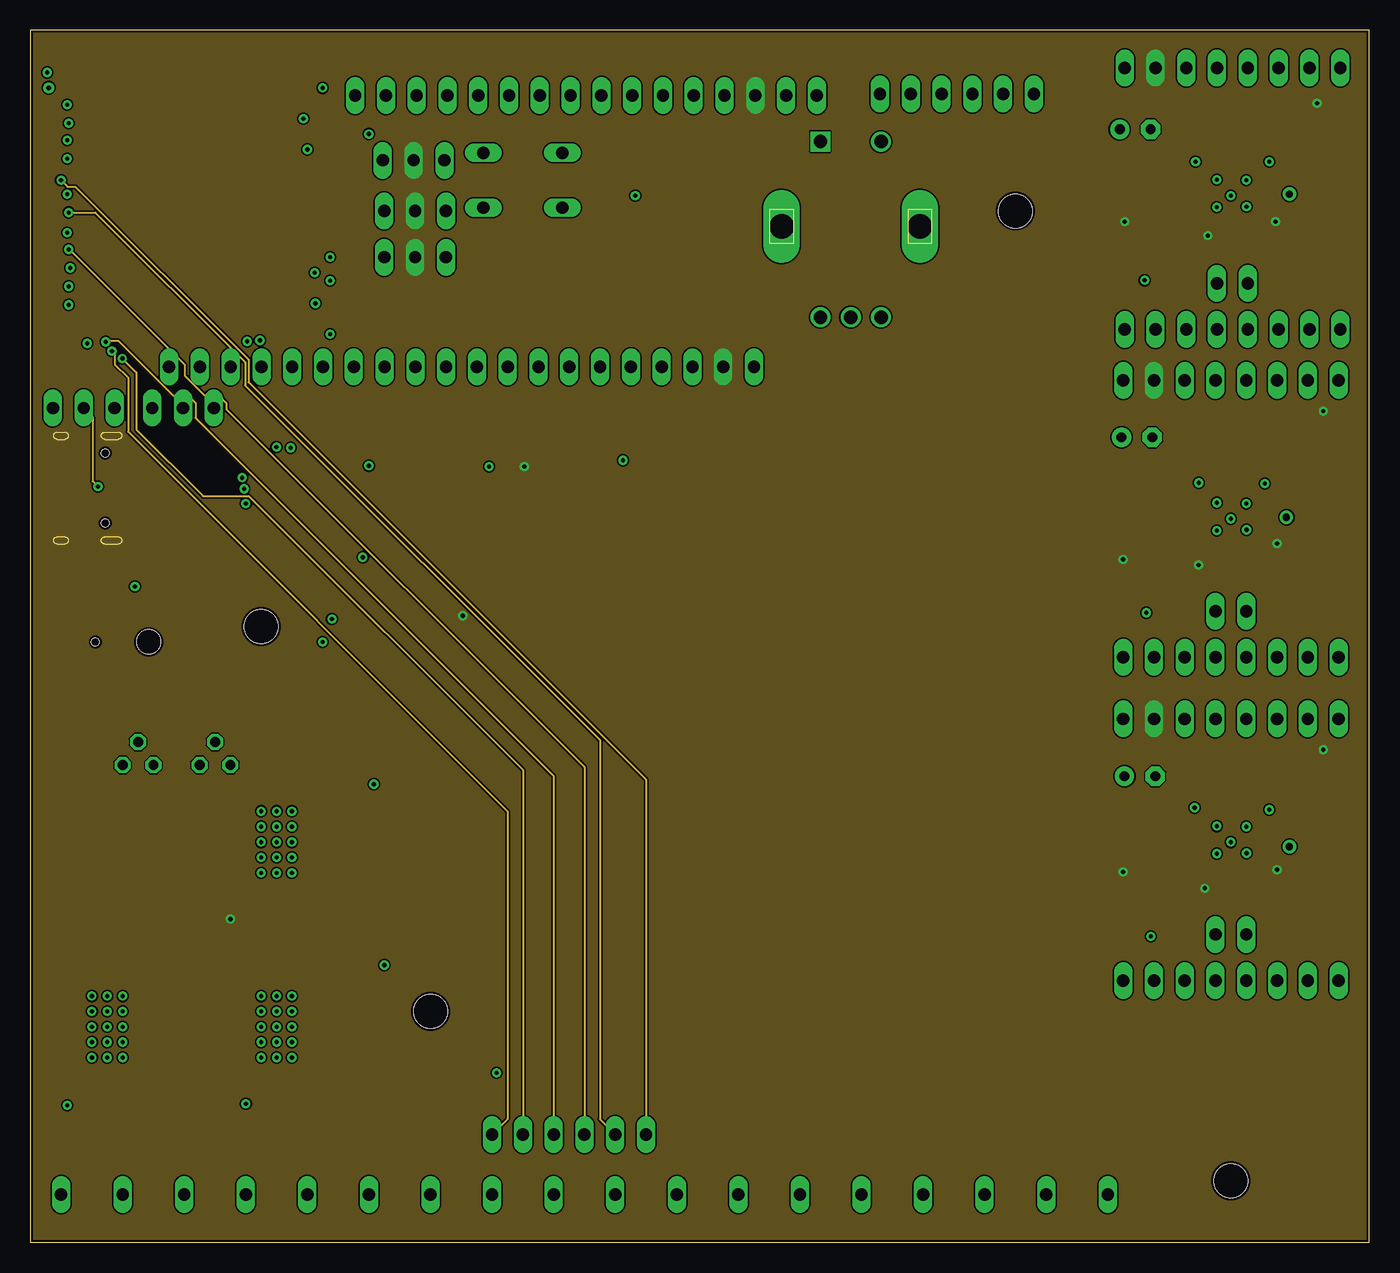
[diagram p3: board, inner layer 5V]
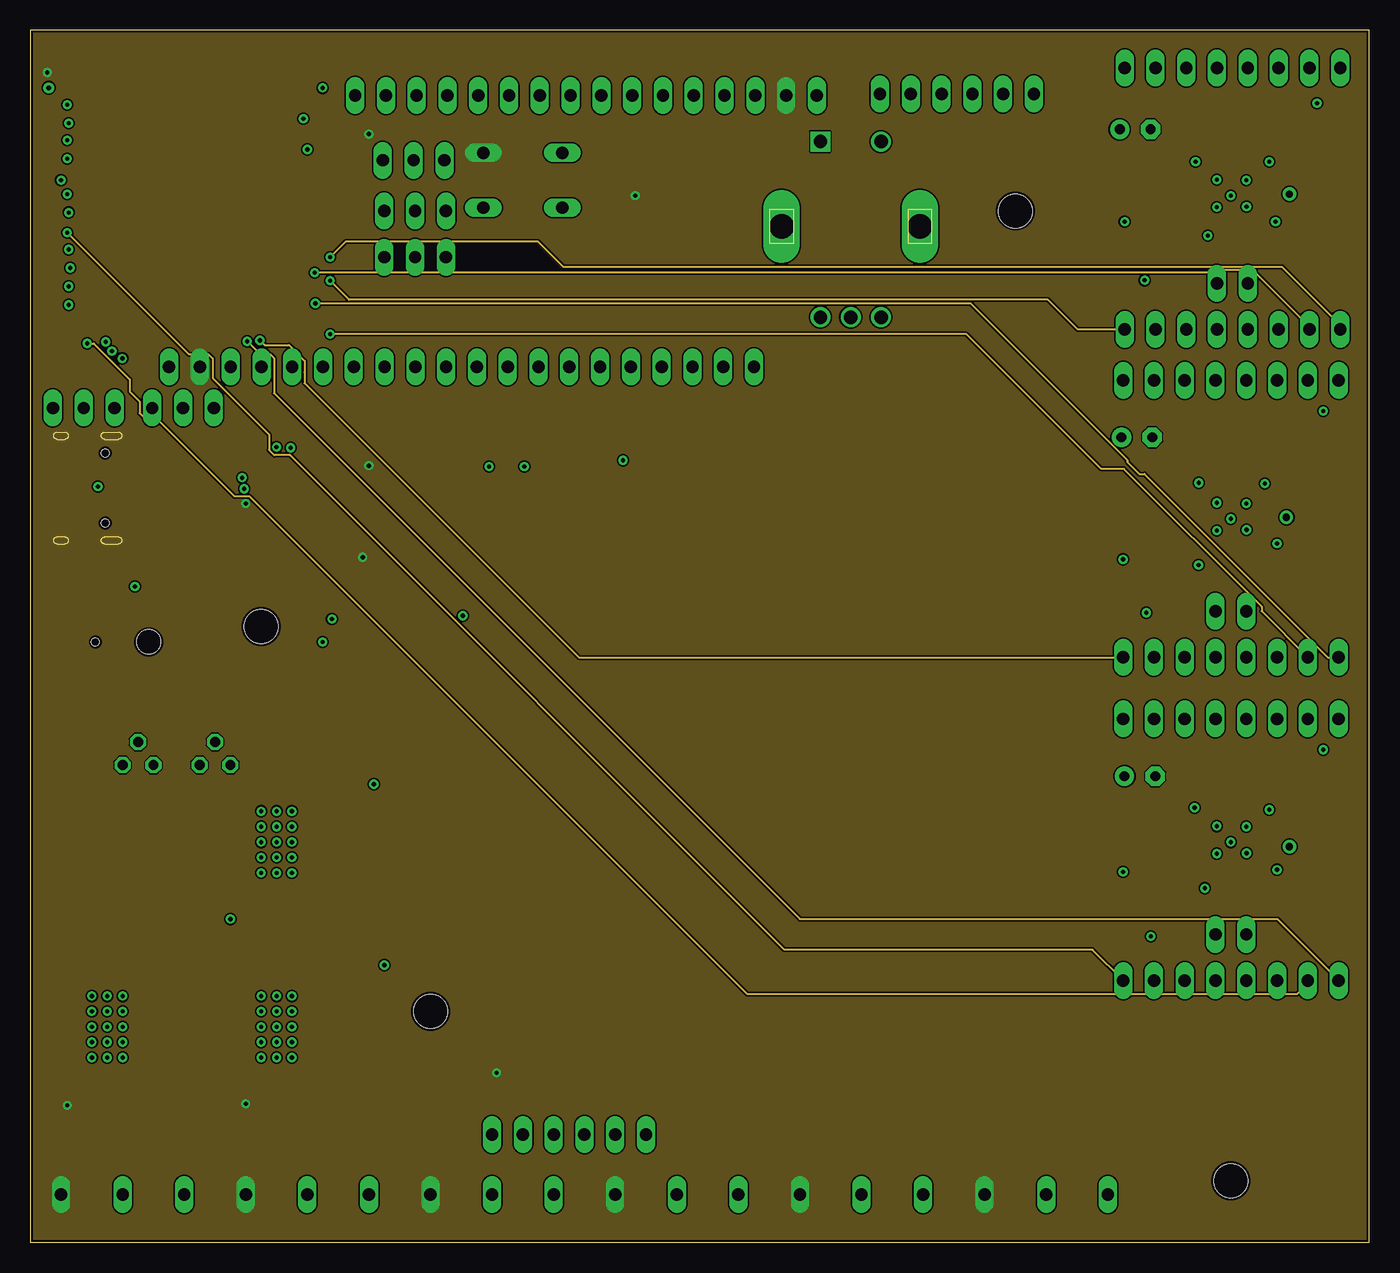
[diagram p4: board, inner layer 3.3V]
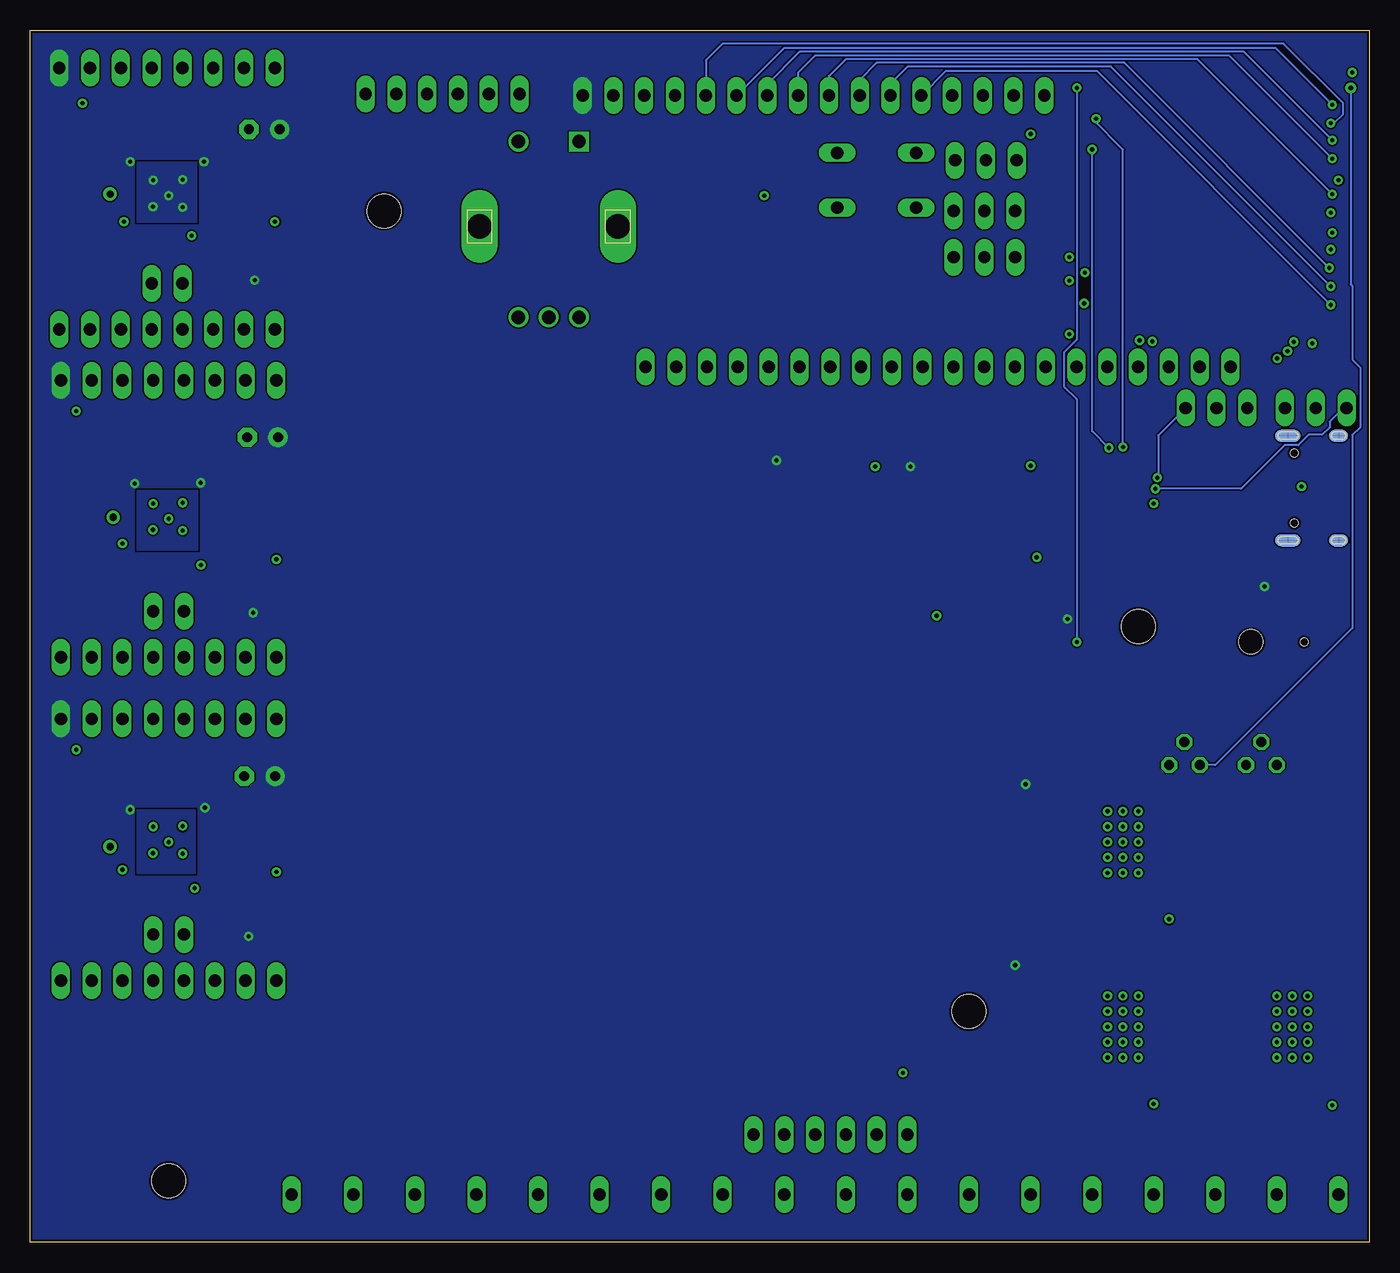
[diagram p5: board, bottom side, seen from below]

Size 110.47 x 100 mm. Coordinates in mm from the lower left corner, seen from the top.
Outline: 0,0 110.47,0 110.47,100 0,100 0,0
Copper layers (1+2*15+16): Top 0.035mm / dielectric 0.2mm / 5V 0.0175mm / dielectric 1.065mm / 3.3V 0.0175mm / dielectric 0.2mm / Bottom 0.035mm
Design rules "jlcpcb-4layers *": minimum track width 3.5mil, minimum drill 0.2mm, track to track 5mil, track to pad 0.2mm, pad to pad 5mil, via to via 6mil, smd to smd 5mil, copper to edge 0.2mm, drill to drill 6mil, minimum pad ring 10mil, minimum via ring 8mil, stop-mask expansion 0.05mm, vias tented up to drill 16mil, thermal gap 10mil

### Footprints (pad centres in the part's own frame; a part is rotated, then mirrored left to right if it is on the bottom)
C1206 = smd 1.6 x 1.8: 1 -1.4,0; 2 1.4,0
E2,5-6 = drill 0.813 pad 1.6: + -1.27,0 | drill 0.813 pad 1.6 octagon: - 1.27,0
CHIP-LED0603 = smd 0.8 x 0.8: A 0,-0.75; C 0,0.75
LED-0603 = smd 1 x 1: A -0.877,0; C 0.877,0
SWITCHSMD3X6MM = smd 1.27 x 2.54: P$1 -0.508,1.524; P$2 6.604,1.397
SMT-JUMPER_2_NO_SILK = smd 0.635 x 1.27: 1 -0.406,0; 2 0.406,0
QFN28-PAD = smd 0.8 x 0.26: 1 -2.5,1.5; 2 -2.5,1; 3 -2.5,0.5; 4 -2.5,0; 5 -2.5,-0.5; 6 -2.5,-1; 7 -2.5,-1.5; 15 2.5,-1.5; 16 2.5,-1; 17 2.5,-0.5; 18 2.5,0; 19 2.5,0.5; 20 2.5,1; 21 2.5,1.5 | smd 0.26 x 0.8: 8 -1.5,-2.5; 9 -1,-2.5; 10 -0.5,-2.5; 11 0,-2.5; 12 0.5,-2.5; 13 1,-2.5; 14 1.5,-2.5; 22 1.5,2.5; 23 1,2.5; 24 0.5,2.5; 25 0,2.5; 26 -0.5,2.5; 27 -1,2.5; 28 -1.5,2.5 | smd 3.4 x 3.4: TP 0,0
MLP28 = smd 0.6 x 0.3: 1 -2.3,1.5; 2 -2.3,1; 3 -2.3,0.5; 4 -2.3,0; 5 -2.3,-0.5; 6 -2.3,-1; 7 -2.3,-1.5; 15 2.3,-1.5; 16 2.3,-1; 17 2.3,-0.5; 18 2.3,0; 19 2.3,0.5; 20 2.3,1; 21 2.3,1.5 | smd 0.3 x 0.6: 8 -1.5,-2.3; 9 -1,-2.3; 10 -0.5,-2.3; 11 0,-2.3; 12 0.5,-2.3; 13 1,-2.3; 14 1.5,-2.3; 22 1.5,2.3; 23 1,2.3; 24 0.5,2.3; 25 0,2.3; 26 -0.5,2.3; 27 -1,2.3; 28 -1.5,2.3 | smd 3.3 x 3.3: EXP 0,0 | smd 0.435 x 0.435: M -2.103,2.103
1X08 = drill 1.016 long: 1 -8.89,0; 2 -6.35,0; 3 -3.81,0; 4 -1.27,0; 5 1.27,0; 6 3.81,0; 7 6.35,0; 8 8.89,0
1X02 = drill 1.016 long: 1 -1.27,0; 2 1.27,0
USB-C-16P-4LAYER-ISOLATED = smd 0.3 x 1: A5 -1.25,-0.34; A6 -0.25,-0.34; A7 0.25,-0.34; A8 1.25,-0.34; B5 1.75,-0.34; B6 0.75,-0.34; B7 -0.75,-0.34; B8 -1.75,-0.34 | smd 0.6 x 1: GND -3.225,-0.34; GND2 3.225,-0.34; VBUS1 -2.45,-0.34; VBUS2 2.45,-0.34 | smd 1 x 2.1: SHLD1 -4.32,-0.915; SHLD2 4.32,-0.915 | smd 1 x 2.1 bottom: SHLD3 -4.32,-0.915; SHLD4 4.32,-0.915 | smd 1 x 1.6: SHLD5 -4.32,-5.095; SHLD8 4.32,-5.095 | smd 1 x 1.6 bottom: SHLD6 -4.32,-5.095; SHLD7 4.32,-5.095 | hole 0.65: -2.89,-1.445; 2.89,-1.445
CLIFF_FC68148S_0 = smd 3 x 2: 1 5.5,-3.65; 1-2 5.5,2.35; 2 -5.5,-3.65; 3 -5.5,2.35 | hole 0.635: 0,2.25 | hole 2: 0,-2.15
JUMPER3-0402_NC = smd 0.8 x 0.8: 1 0,1.1; 2 0,0; 3 0,-1.1
1X03 = drill 1.016 long: 1 -2.54,0; 2 0,0; 3 2.54,0
1X20 = drill 1.016 long: 1 -24.13,0; 2 -21.59,0; 3 -19.05,0; 4 -16.51,0; 5 -13.97,0; 6 -11.43,0; 7 -8.89,0; 8 -6.35,0; 9 -3.81,0; 10 -1.27,0; 11 1.27,0; 12 3.81,0; 13 6.35,0; 14 8.89,0; 15 11.43,0; 16 13.97,0; 17 16.51,0; 18 19.05,0; 19 21.59,0; 20 24.13,0
1X06 = drill 1.016 long: 1 -6.35,0; 2 -3.81,0; 3 -1.27,0; 4 1.27,0; 5 3.81,0; 6 6.35,0
1X16 = drill 1.016 long: 1 -19.05,0; 2 -16.51,0; 3 -13.97,0; 4 -11.43,0; 5 -8.89,0; 6 -6.35,0; 7 -3.81,0; 8 -1.27,0; 9 1.27,0; 10 3.81,0; 11 6.35,0; 12 8.89,0; 13 11.43,0; 14 13.97,0; 15 16.51,0; 16 19.05,0
POTMETER = drill 1.016 long: 1 1.27,1.27; 3 6.35,1.27; 5 11.43,1.27
XDCR_PEC11R-4215F-S0024 = drill 1.1 square: 1 -2.5,7 | drill 1.1: 2 2.5,7; A -2.5,-7.5; B 2.5,-7.5; COM 0,-7.5 | drill 2 long: S1 -5.7,0; S2 5.7,0
TO92 = drill 0.813 octagon: 1 1.27,0; 2 0,1.905; 3 -1.27,0
R1206 = smd 1.6 x 1.803: 1 -1.422,0; 2 1.422,0
RTRIM3103 = smd 1.2 x 1.25: 1 -1,-1.225; 3 1,-1.225 | smd 1.3 x 1.3: 2 0,1.3
PAD-0.6-1.1 = drill 0.6 pad 1.1: 1 0,0
B3F-10XX = drill 1.016 long: 1 -3.251,2.261; 2 3.251,2.261; 3 -3.251,-2.261; 4 3.251,-2.261
SJ = smd 1.168 x 1.6: 1 -0.762,0; 2 0.762,0
TP_15TH = drill 0.381 pad 0.61: P$1 0,0
ESP32-S2-WROOM = smd 0.9 x 1.5: 1 11.94,8.25; 2 10.44,8.25; 3 8.94,8.25; 4 7.44,8.25; 5 5.94,8.25; 6 4.44,8.25; 7 2.94,8.25; 8 1.44,8.25; 9 -0.06,8.25; 10 -1.56,8.25; 11 -3.06,8.25; 12 -4.56,8.25; 13 -6.06,8.25; 14 -7.56,8.25; 15 -9.06,8.25; 16 -10.56,8.25; 27 -10.56,-8.24; 28 -9.06,-8.24; 29 -7.56,-8.24; 30 -6.06,-8.24; 31 -4.56,-8.24; 32 -3.06,-8.24; 33 -1.56,-8.24; 34 -0.06,-8.24; 35 1.44,-8.24; 36 2.94,-8.24; 37 4.44,-8.24; 38 5.94,-8.24; 39 7.44,-8.24; 40 8.94,-8.24; 41 10.44,-8.24; 42 11.94,-8.24 | smd 1.5 x 0.9: 17 -10.82,6.75; 18 -10.82,5.25; 19 -10.82,3.75; 20 -10.82,2.25; 21 -10.82,0.75; 22 -10.82,-0.75; 23 -10.82,-2.25; 24 -10.82,-3.75; 25 -10.82,-5.25; 26 -10.82,-6.75 | smd 1.1 x 1.1: GNDEP0 3.88,1.15; GNDEP1 5.38,-0.35; GNDEP2 5.38,1.15; GNDEP3 5.38,2.65; GNDEP4 3.88,2.65; GNDEP5 2.38,2.65; GNDEP6 2.38,1.15; GNDEP7 2.38,-0.35; GNDEP8 3.88,-0.35
SOT229P700X180-4N = smd 1.31 x 0.93: 1 -3.345,2.29; 2 -3.345,0; 3 -3.345,-2.29 | smd 1.31 x 3.24: 4 3.345,0
2,8 = hole 2.8: 0,0
CRYSTAL-SMD-3.2X1.5MM = smd 1 x 1.8: P$1 -1.25,0; P$2 1.25,0

### Placement (x,y rotation side)
C1  47.99,60.7 90 top
C2  34.59,60.7 270 top
C3  31.91,60.7 270 top
C4  34.32,67.43 90 top
C5  31.9,67.44 90 top
C6  50.67,60.7 90 top
C7  52.72,67.43 90 top
C7A1  47.49,67.43 90 top
C7A2  37.02,67.43 90 top
C7A3  39.63,67.43 90 top
C7B1  50.11,67.43 90 top
C7B2  26.67,53.19 90 top
C7B3  42.25,67.43 90 top
C8  31.67,53.19 90 top
C9  94.11,26.92 90 top
C10  94.11,32.52 270 top
C11  60.58,67.43 90 top
C12  39.95,60.7 90 top
C13  45.31,60.7 90 top
C14  55.34,67.43 90 top
C15  93.98,53.59 90 top
C16  93.98,59.82 270 top
C17  57.96,67.43 90 top
C18  34.16,53.19 270 top
C19  42.63,60.7 90 top
C20  37.27,60.7 270 top
C21  93.47,80.52 90 top
C22  93.47,86.36 270 top
C23  44.87,67.43 90 top
C24  12.56,21.59 270 top
C25  12.56,15.49 270 top
C26  26.53,21.59 270 top
C27  26.53,15.62 270 top
C28  26.53,36.45 270 top
C29  26.53,30.48 270 top
C30  53.72,78.74 0 top
C31  91.54,38.45 0 top
C32  91.3,66.42 0 top
C33  91.16,91.83 0 top
C34  24.91,86.77 0 top
D1  12.7,11.43 270 top
D2  26.67,11.43 270 top
D3  3.81,35.56 0 top
D4  26.67,26.67 270 top
GPIO0  2.54,25.4 0 top
GPIO18PU  30.99,13.84 90 top
IC1  99.06,33.02 0 top
IC2  99.06,59.69 0 top
IC3  99.19,86.74 0 top
IC4  21.59,62.23 0 top
J1  99.06,43.18 180 top
J3  99.06,25.4 0 top
J5  7.62,62.23 270 top
J6  99.06,21.59 180 top
J7  99.06,71.12 180 top
J8  99.06,52.07 0 top
J9  99.06,48.26 180 top
J10  99.19,96.9 180 top
J11  99.19,79.12 0 top
J12  99.19,75.31 180 top
J13  7.62,49.53 90 top
JMP1  103.38,26.8 0 top
JMP2  103,81.66 0 top
JMP3  102.87,54.61 0 top
JP1  12.6,68.83 0 top
JP2  4.41,68.83 0 top
JP3  31.75,81.28 0 top
JP4  31.75,85.09 0 top
JP5  35.58,72.23 180 top
JP6  31.62,89.28 0 top
JP7  76.45,94.74 0 top
JP8  44.45,8.89 180 top
JP9  45.85,94.61 180 top
MOTOR1  1.27,2.67 0 top
MOTOR2  16.51,2.67 0 top
MOTOR3  31.75,2.67 0 top
MOTOR4  46.99,2.67 0 top
MOTOR5  62.23,2.67 0 top
MOTOR6  77.47,2.67 0 top
MT1  67.69,83.82 0 top
Q1  15.24,39.37 0 top
Q3  8.89,39.37 0 top
R1  26.54,60.7 90 top
R2  96.52,38.96 270 top
R3  101.6,38.96 270 top
R4  2.92,39.65 270 top
R5  12.55,60.96 180 top
R6  106.81,61.09 180 top
R7  104.78,38.96 90 top
R8  106.96,29.08 180 top
R9  12.55,58.42 0 top
R10  29.17,53.19 90 top
R11  26.54,67.43 270 top
R12  29.16,67.43 270 top
R13  90.17,26.95 270 top
R14  35.41,13.97 0 top
R15  96.27,66.7 270 top
R16  101.6,66.7 270 top
R17  12.68,34.42 180 top
R18  12.68,31.5 0 top
R19  106.81,87.76 180 top
R20  104.9,66.7 90 top
R21  106.83,54.61 180 top
R22  90.17,53.49 270 top
R23  96.65,92.81 270 top
R24  101.73,92.81 270 top
R26  104.52,92.81 90 top
R27  106.96,82.93 180 top
R28  90.3,80.54 270 top
R29  29.22,60.7 90 top
R30  6.35,11.43 0 top
R31  21.59,11.43 0 top
R32  20.32,26.67 0 top
R33  53.72,82.55 180 top
R34  53.72,86.36 180 top
R35  53.72,90.17 180 top
R36  39.37,82.55 180 top
R37  106.68,34.29 180 top
REF1  103.89,32.64 0 top
REF2  103.89,86.49 0 top
REF3  103.63,59.82 0 top
RESET  2.41,30.73 0 top
S1  40.64,87.63 0 top
SJ1  26.18,90.24 90 top
SJ2  58.44,82.94 90 top
SUSPENDINV  22.86,67.31 0 top
TP1  1.52,95.25 0 top
U1  12.95,86.49 90 top
U2  6.35,17.78 180 top
U3  20.32,17.78 180 top
U4  20.32,33.02 180 top
U$1  [2,8]  99.06,5.08 0 top
U$2  [2,8]  81.28,85.09 0 top
U$3  [2,8]  33.02,19.05 0 top
U$4  [2,8]  19.05,50.8 0 top
Y1  27.94,77.47 270 top

### Tracks (layer width: path | path; a pad name or v marks a point on that pad's centre or on a via)
0
  Top 0.152: GPIO0.P$2 11.12,26.8 12.7,28.38 12.7,38.1 Q1.3 | TP1.P$1 1.7,95.43 U1.3
  Bottom 0.152: TP1.P$1 1.52,79.04 1.39,78.91 1.39,72.82 0.73,72.16 0.73,67.24 1.39,66.58 1.39,50.68 12.7,39.37 Q1.3
1BRA
  Top 0.152: R3.2 100.64,36.58 100.64,36.5 100.06,35.93 IC1.23
1BRB
  Top 0.152: R2.2 97.48,36.58 97.48,36.5 98.06,35.93 IC1.27
1CPI
  Top 0.152: IC1.5 95.51,32.52 C10.2
1CPO
  Top 0.152: IC1.4 95,33.02 C10.1
1DIAG
  Top 0.152: IC1.11 99.06,26.67 J3.1
1DIR  (via drill 0.35)
  Top 0.152: J6.1 107.3,22.24 107.3,30.46 107.95,31.11 107.95,33.54 107.57,33.92 105.82,33.92 105.42,33.52 IC1.19 | v17.89,74.33 16.7,75.52 U1.24
  3.3V 0.152: J6.1 102.87,26.67 63.5,26.67 20.11,70.06 20.11,72.93 19.78,73.27 18.95,73.27 v17.89,74.33
1EN  (via drill 0.35)
  Top 0.152: J6.8 R13.2 92.71,28.07 92.71,34.8 92.98,35.07 95.1,35.07 96.15,34.03 IC1.2 | v3.05,83.31 3.16,83.43 U1.11
  3.3V 0.152: J6.8 87.63,24.13 62.23,24.13 21.42,64.94 20.14,64.94 19.71,65.37 19.71,66.65 15.05,71.31 15.05,72.92 14.69,73.28 13.08,73.28 v3.05,83.31
1INDEX
  Top 0.152: IC1.12 99.56,26.17 J3.2
1MS1
  Top 0.152: IC1.9 98.06,28.42 96.19,26.55 96.19,25.07 J6.7
1MS2
  Top 0.152: IC1.10 98.56,28.41 96.68,26.53 96.68,23.02 J6.6
1OA1
  Top 0.152: IC1.24
  Top 0.406: IC1.24 99.57,36.57 99.83,36.83 99.83,42.68 J1.4
1OA2
  Top 0.406: J1.3 103.22,42.83 103.22,35.55 102.19,34.52 IC1.21
1OB1
  Top 0.152: IC1.26
  Top 0.406: IC1.26 98.56,36.49 98.04,37.02 98.04,42.93 J1.5
1OB2
  Top 0.406: J1.6 95.15,43.08 95.15,35.69 96.32,34.52 IC1.1
1PDN_UART
  Top 0.152: JMP1.2 103.25,26.8 102.61,27.43 102.61,28.47 IC1.14 102.13,30.52 102.52,30.13 104.49,30.13 R8.2
1STEP  (via drill 0.35)
  Top 0.152: J6.2 106.68,22.86 106.68,30.61 105.65,31.64 102.58,31.64 102.19,32.02 IC1.16 | v4.7,74.17 U1.16 3.65,74.88 3.65,71.28 3.27,70.89 3.27,67.24 3.65,66.85 3.65,57.4 3.6,57.34 2.54,56.28 2.54,56.15 2.54,56.03 2.54,52.2 2.53,52.1 2.54,52.09 2.54,52.07 3.65,50.8 3.65,41.81 R4.1
  3.3V 0.152: J6.2 105.41,21.37 104.52,20.48 59.15,20.48 18.06,61.57 16.83,61.57 10.61,67.79 9.63,67.79 9.02,68.4 9.02,69.38 8.22,70.18 8.22,71.19 5.24,74.17 v4.7,74.17
1VCP
  Top 0.152: IC1.6 96.08,32.01 95.79,31.72 95.79,30 C9.2
1VREF
  Top 0.152: IC1.17 103.77,32.52 REF1.1 104.24,32.99 R37.2
1VREF1
  Top 0.152: R7.1 105.65,37.54 R37.1
2BRA
  Top 0.152: IC2.23 100.05,62.2 100.05,62.6 100.99,63.55 100.99,63.75 101.6,64.36 R16.2
2BRB
  Top 0.152: IC2.27 98.06,62.74 97.13,63.67 97.13,63.75 96.52,64.36 96.52,65.02 R15.2
2CPI
  Top 0.152: IC2.5 95.83,59.19 95.06,58.42 C16.2
2CPO
  Top 0.152: C16.1 95.51,59.69 IC2.4
2DIAG
  Top 0.152: IC2.11 99.06,53.34 J8.1
2DIR  (via drill 0.35)
  Top 0.152: J9.1 107.17,49.04 107.17,58.41 107.81,59.05 107.81,60.49 107.38,60.92 106.72,60.92 106.68,60.96 103.16,60.96 102.39,60.19 IC2.19 | v23.52,77.47 23.48,77.43 U1.28
  3.3V 0.152: J9.1 107.05,48.26 91.92,63.39 91.49,63.39 90.5,64.38 90.5,64.53 77.56,77.47 v23.52,77.47 | v23.52,77.47
2EN  (via drill 0.35)
  Top 0.152: J9.8 R22.2 90.17,52.63 92.57,55.03 92.57,61.9 93.04,62.38 94.82,62.38 95.87,61.32 95.87,60.89 96.07,60.69 IC2.2 | v18.95,74.42 18.2,75.16 U1.25
  3.3V 0.152: J9.8 45.26,48.26 22.63,70.89 22.63,71.78 22.65,71.8 22.65,72.72 21.34,74.03 19.34,74.03 v18.95,74.42
2INDEX
  Top 0.152: IC2.12 99.56,52.84 J8.2
2MS1
  Top 0.152: IC2.9 98.06,55.2 96.27,53.4 96.27,51.81 J9.7
2MS2
  Top 0.152: IC2.10 98.56,55.21 96.62,53.27 96.62,49.63 J9.6
2OA1
  Top 0.152: IC2.24 99.55,62.2
  Top 0.406: 99.55,62.2 99.55,63.87 100.13,64.46 100.13,70.92 J7.4
2OA2
  Top 0.406: J7.3 103,70.99 103,62.63 IC2.21
2OB1
  Top 0.152: IC2.26 98.6,62.23
  Top 0.406: 98.6,62.23 98.6,63.88 97.79,64.7 J7.5
2OB2
  Top 0.406: J7.6 95.25,69.74 94.75,69.24 94.75,63.25 96.56,61.44 IC2.1
2PDN_UART
  Top 0.152: JMP3.2 102.56,54.61 102.01,55.16 102.01,55.74 IC2.14 102.48,57.19 102.62,57.05 102.97,57.05 R21.2
2STEP  (via drill 0.35)
  Top 0.152: J9.2 106.68,49.53 106.68,56.74 105.15,58.27 104.32,58.27 103.89,58.7 101.57,58.7 IC2.16 | v24.74,74.93 23.46,74.93 22.46,75.93 U1.27
  3.3V 0.152: v24.74,74.93 77.25,74.93 88.38,63.81 90.25,63.81 101.6,52.45 101.6,52.07 J9.2
2VCP
  Top 0.152: C15.2 93.98,56.11 95.77,57.9 95.77,58.37 96.08,58.69 IC2.6
2VREF
  Top 0.152: IC2.17 102.24,59.19 102.87,59.82 REF3.1 103.66,59.79 R6.2
2VREF1
  Top 0.152: R6.1 107.81,62.37 R20.1
3.3V  (via drill 0.35)
  Top 0.152: v27.94,64.07 27.94,63.41 R29.2 31.88,62.12 C3.1 C2.1 | v27.43,56.52 27.43,56.35 R10.2 | C25.1 11.67,17.78 U2.2 8.23,16.31 8.23,16.26 7.82,15.85 7.37,15.85 6.96,15.44 6.96,14.99 6.6,14.63 6.55,14.63 4.93,13.01 R30.1 4.8,11.3 v3.05,11.3 | R35.2 R34.2 | R34.2 R33.2 | R34.2 v49.91,86.36 | U1.2 4.3,96.52 v1.39,96.52 | IC4.6 IC4.7 19.06,60.96 v17.78,60.96 | v17.78,11.43 R31.1 20.32,11.43 23.12,14.23 24.14,14.23 24.6,14.69 24.6,16.3 23.66,17.24 U3.2 25.77,17.78 C27.1 | R14.2 v38.48,13.97 | SJ1.2 26.61,91.44 v27.94,91.44
  pour 3.3V (rank 4, no thermals): -35.56,129.54 180.34,129.54 182.88,132.08 182.88,-17.78 -53.34,-17.78 -53.34,111.76
3BRA
  Top 0.152: IC3.23 100.17,89.26 100.17,89.67 101.73,91.23 R24.2
3BRB
  Top 0.152: IC3.27 98.18,89.72 96.65,91.25 R23.2
3CPI
  Top 0.152: IC3.5 96.66,86.22 96.04,86.22 94.79,84.96 C22.2
3CPO
  Top 0.152: IC3.4 94.49,86.74 C22.1
3DIAG
  Top 0.152: IC3.11 99.19,80.39 J11.1
3DIR  (via drill 0.35)
  Top 0.152: J12.1 107.29,76.1 107.29,85.22 107.98,85.91 107.98,87.26 107.53,87.72 102.63,87.72 102.17,87.25 101.7,87.25 IC3.19 | v24.74,81.28 20.93,81.28 21.38,81.74 U1.31
  3.3V 0.152: J12.1 108.08,75.69 103.28,80.49 43.97,80.49 41.91,82.55 26.01,82.55 v24.74,81.28
3EN  (via drill 0.35)
  Top 0.152: J12.8 R28.2 90.3,79.66 92.06,81.42 92.06,88.56 92.38,88.88 94.48,88.88 95.61,87.74 IC3.2 | v24.74,79.34 21.6,79.34 U1.29
  3.3V 0.152: J12.8 86.42,75.31 83.96,77.78 26.3,77.78 v24.74,79.34
3INDEX
  Top 0.152: IC3.12 99.69,79.89 J11.2
3MS1
  Top 0.152: IC3.9 98.17,84.22 98.17,83.21 95,80.04 95,77.47 J12.7
3MS2
  Top 0.152: J12.6 95.38,79.53 98.67,82.83 98.67,84.22 IC3.10
3OA1
  Top 0.152: IC3.24
  Top 0.406: J10.4 99.69,96.13 IC3.24
3OA2
  Top 0.406: IC3.21 102.58,88.24 103.12,88.79 103.12,96.77 J10.3
3OB1
  Top 0.152: 98.68,89.25 IC3.26
  Top 0.406: 98.68,89.25 98.68,89.95 98.27,90.36 98.27,96.55 J10.5
3OB2
  Top 0.406: IC3.1 95.85,88.24 94.98,89.12 94.98,96.5 J10.6
3PDN_UART
  Top 0.152: JMP2.2 102.8,81.66 101.41,83.05 101.41,83.52 IC3.14 101.45,83.48 103.81,83.48 104.36,82.93 R27.2
3STEP  (via drill 0.35)
  Top 0.152: J12.2 106.68,76.45 106.68,84.2 105.23,85.65 101.78,85.65 IC3.16 | v23.47,80.01 21.61,80.01 U1.30
  3.3V 0.152: J12.2 105.54,75.55 100.88,80.2 97.51,80.2 97.31,80.01 v23.47,80.01
3VCP
  Top 0.152: IC3.6 96.68,85.75 96.26,85.75 95.66,85.15 95.66,84.1 C21.2
3VREF
  Top 0.152: IC3.17 101.72,86.27 103.67,86.27 REF2.1 103.92,86.46 R19.2
3VREF1
  Top 0.152: R26.1 105.4,91.39 R19.1
+5V  (via drill 0.35)
  Top 0.152: C18.2 34.26,51.69 v35.69,51.69 | C29.1 25.39,33.02 U4.2 23.66,32.97 21.79,31.09 21.34,31.09 20.98,30.73 20.98,30.02 18.9,27.94 R32.1 v16.51,26.67 | IC1.15 102.31,30.77 102.83,30.77 v102.87,30.73 | IC2.15 101.57,58.2 102.32,58.2 v102.87,57.66 | IC2.8 97.07,56.7 97.07,56.55 v96.39,55.88 | v96.9,29.21 96.94,29.25 96.94,29.9 IC1.8 | IC3.15 v102.74,84.2 | IC3.8 97.19,83.75 97.19,83.1 v97.16,83.06 | v106.17,93.98 105.92,94.23 R26.2 | R28.1 v90.3,84.2 | v40.77,64.01 40.77,62.92 C12.2 C19.2 C13.2 C1.2 C6.2 | R22.1 v90.17,56.35 | R13.1 v90.17,30.57 | R20.2 105.36,68.58 v106.68,68.58 | R7.2 105.03,40.64 v106.68,40.64
  pour 5V (rank 3, no thermals): -27.94,121.92 158.75,121.92 161.29,119.38 161.29,-7.62 160.02,-8.89 158.75,-10.16 -39.37,-10.16 -27.94,1.27
A0  (via drill 0.35)
  Top 0.152: JP8.6 12.57,8.89 MOTOR1.3 | U1.20 10.63,75.6 10.63,75.34 8.83,73.53 v6.73,73.53
  5V 0.152: JP8.6 39.37,10.16 39.37,35.56 8.06,66.87 8.06,71.35 6.99,72.43 6.99,73.28 v6.73,73.53
A1  (via drill 0.35)
  Top 0.152: MOTOR2.3 25.27,6.35 38.1,6.35 JP8.5 40.36,8.89 38.53,10.72 33.7,10.72 GPIO18PU.1 | U1.21 12.2,75.33 11.51,74.64 10.7,74.64 8.98,72.92 v7.59,72.92
  5V 0.152: v7.59,72.92 8.75,71.77 8.75,67.06 14.25,61.57 18.03,61.57 40.64,38.96 JP8.5
A2  (via drill 0.35)
  Top 0.152: JP8.4 38.23,3.94 MOTOR3.3 | U1.17 6.22,75.65 v6.22,74.3
  5V 0.152: v6.22,74.3 6.3,74.38 7.27,74.38 11.78,69.87 13.03,69.87 13.64,69.26 13.64,68.01 43.18,38.47 JP8.4
A3  (via drill 0.35)
  Top 0.152: MOTOR4.3 51.41,5.87 47.85,5.87 45.72,8 JP8.3 | U1.12 3.19,81.93 v3.17,81.92
  5V 0.152: JP8.3 45.72,39.2 16.18,68.74 16.18,69.26 15.57,69.87 14.39,69.87 12.75,71.51 12.75,72.4 3.24,81.92 v3.17,81.92
A4  (via drill 0.35)
  Top 0.152: MOTOR5.3 66.17,6.35 50.8,6.35 JP8.2 | U1.10 3.21,84.93 v3.17,84.96
  5V 0.152: JP8.2 46.99,10.16 46.99,41.43 17.72,70.7 17.72,72.61 5.36,84.96 v3.17,84.96
A5  (via drill 0.35)
  Top 0.152: JP8.1 78.87,8.89 MOTOR6.3 | U1.8 2.84,87.93 v2.54,87.63
  5V 0.152: v2.54,87.63 3.08,87.09 3.73,87.09 18.01,72.81 18.01,70.96 50.8,38.17 JP8.1
CC1
  Top 0.152: J5.A5 7.3,63.46 7.94,63.46 11.56,67.08 11.56,70.02 12.17,70.63 13.03,70.63 13.28,70.38 14.46,70.38 14.71,70.63 15.58,70.63 16.99,69.22 23.5,69.22 25.09,67.61 27.12,67.61 28.72,66.01 R12.2
CC2
  Top 0.152: J5.B5 7.89,60.49 14.32,66.91 21.19,66.91 21.78,67.5 21.78,68.04 22.04,68.3 23.68,68.3 23.94,68.04 23.94,67.5 24.13,67.31 25.25,67.31 R11.2
CHIP_PU  (via drill 0.35)
  Top 0.152: Q3.3 7.62,33.53 RESET.P$2 9.02,31.88 7.62,30.48 7.62,24.13 8.26,23.5 10.07,23.5 18.44,31.86 18.44,32 18.8,32.36 19.25,32.36 19.66,32.77 19.66,33.22 20.07,33.63 20.52,33.63 20.93,34.04 20.93,34.48 21.34,34.9 21.79,34.9 22.2,35.31 22.2,35.62 29.21,42.63 29.21,51.77 R10.1 | R10.1 26.93,49.53 v24.13,49.53 | U1.41 22.46,96.93 23.29,96.11 23.31,96.11 24.13,95.28 v24.13,95.25 | R10.1 29.19,51.79 C8.1
  Bottom 0.152: v24.13,49.53 24.13,69.56 25.19,70.62 25.19,73.42 24.13,74.48 v24.13,95.25
CLK  (via drill 0.35)
  Top 0.152: U1.15 3.26,77.43 v3.17,77.34 | JP5.6 47.62,72.85 47.62,88.9 45.57,90.96 40.64,90.96 36.98,94.61 JP9.12
  Bottom 0.152: v3.17,77.34 22.48,96.65 34.92,96.65 JP9.12
CP210X_D+  (via drill 0.35)
  Top 0.152: IC4.4 18.93,62.23 18.07,63.08 v17.47,63.08
  Bottom 0.152: JP1.3 17.4,66.57 17.4,63.15 v17.47,63.08
CP210X_D-  (via drill 0.35)
  Top 0.152: IC4.5 18.13,61.72 17.68,62.17 v17.65,62.17
  Bottom 0.152: v17.65,62.17 10.57,62.17 6.97,65.77 5.83,65.77 4.98,66.63 3.88,66.63 3.27,67.24 3.27,67.7 2.14,68.83 JP2.1
CS  (via drill 0.35)
  Top 0.152: U1.13 3.34,80.43 v3.3,80.39 | JP9.10 42.04,93.85 44.07,91.82 45.85,91.82 48.9,88.77 48.9,75.56 52.09,72.37 JP5.4
  Bottom 0.152: v3.3,80.39 20.22,97.31 40.64,97.31 42.04,95.91 JP9.10
DTR
  Top 0.152: R17.1 13.78,34.73 13.78,36.64 Q1.1 15.57,40.31 13.68,40.31 12.56,41.43 12.56,50.67 13.97,52.08 13.97,55.99 12.56,57.26 12.56,62.16 15.31,64.91 19.8,64.91 20.09,64.61 IC4.28
ESP32_D+
  Top 0.152: U1.23 15.2,75.58 14.26,74.64 13.3,74.64 12.7,74.04 10.94,74.04 10.06,73.16 JP1.1
ESP32_D-
  Top 0.152: JP2.3 6.95,70.45 10.85,74.35 12.48,74.35 13.7,75.58 U1.22
GND  (via drill 0.35)
  other vias: 97.89,87.68 100.33,87.63 99.06,86.36 97.9,85.4 100.35,85.45 97.89,34.34 100.33,34.29 99.06,33.02 97.9,32.06 100.35,32.11 97.89,61.01 100.33,60.96 99.06,59.69 97.9,58.73 100.35,58.78
  pour Top (no thermals): -3.81,101.6 -3.81,-2.54 125.73,-2.54 125.73,101.6
  pour Bottom: 96.74,89.09 101.64,89.09 101.64,84.21 96.74,84.21
GND1
  pour Bottom: 96.65,61.97 101.65,61.97 101.65,57.14 96.65,57.14
GND2
  pour Bottom: 96.85,35.62 101.65,35.62 101.65,30.49 96.85,30.49
KNOP1
  Top 0.152: 22.28,88.21 22.24,88.17 21.44,88.17 U1.35 | R36.2 38.09,82.59 38.09,84.67 S1.3 35.48,87.28 35.48,95.84 34.87,96.45 28.93,96.45 27.09,94.61 JP9.16 26.8,93.4 25.1,91.7 25.1,91.03 22.28,88.21 | 22.28,88.21 23.51,86.98 C34.1
MOSI  (via drill 0.35)
  Top 0.152: U1.14 3.23,78.93 v3.17,78.87 | JP5.5 49.55,73.21 48.26,74.5 48.26,88.9 45.64,91.52 42.63,91.52 39.53,94.61 JP9.11
  Bottom 0.152: v3.17,78.87 21.31,97 38.1,97 39.5,95.61 JP9.11
N$1
  Top 0.152: IC4.11 21.59,59.43 21.84,59.18 26.44,59.18 R1.1
N$2
  Top 0.152: R4.2 2.92,35.57 D3.A
N$3
  Top 0.152: J5.B6 7.3,61.44 8.41,61.44 8.89,61.91 8.89,63.5 | J5.A6 7.3,62.55 7.94,62.55 8.89,63.5 | 8.89,63.5 12.6,67.21 JP1.2
N$4
  Top 0.152: R9.2 R5.1 15,59.93 IC4.8
N$5  (via drill 0.35)
  Top 0.152: 6.44,62.23 6.7,61.97 J5.A7 | J5.B7 6.67,62.98 6.46,62.77 6.46,62.23 6.44,62.23 | 6.44,62.23 5.71,62.23 v5.59,62.36
  5V 0.152: v5.59,62.36 5.14,62.81 5.14,68.1 JP2.2
N$7
  Top 0.152: U1.18 7.7,76.28 9.57,78.15 22.05,78.15 22.64,78.73 Y1.P$1 30.05,78.72 35.59,73.19 35.59,70.1 C4.2
N$8
  Top 0.152: U1.19 9.2,76.03 9.87,76.7 25.8,76.7 26.27,76.22 27.87,76.22 | 27.87,76.22 30.37,73.72 30.37,70.08 31.62,68.84 C5.2 | Y1.P$2 27.87,76.22
N$9
  Top 0.152: JMP1.1 103.46,27.9 104.07,27.3 104.07,25.18 100.47,21.59 J6.4
N$10
  Top 0.152: R17.2 11.42,34.42 11.42,39.72 9.87,41.27 Q3.2
N$11
  Top 0.152: JMP1.3 101.22,23.54 99.97,23.54 98.02,21.59 J6.5
N$12
  Top 0.152: Q1.2 16.02,41.27 17.55,39.74 17.55,39.03 15.18,36.66 15.18,33.36 14.1,32.28 R18.2
N$13
  Top 0.152: JMP3.1 103.26,55.71 103.66,55.31 103.66,51.59 J9.4
N$14
  Top 0.152: R14.1 34.27,14.25 GPIO18PU.2
N$15
  Top 0.152: JMP3.3 101.48,52.12 101.48,50.79 100.76,50.07 99.6,50.07 J9.5
N$16
  Top 0.152: JMP2.1 103.08,82.76 103.73,82.12 103.73,78.58 J12.4
N$17
  Top 0.152: JMP2.3 101.52,79.08 101.52,77.8 100.85,77.13 99.73,77.13 J12.5
N$18  (via drill 0.35)
  other vias: 19.05,35.56
N$19
  Top 0.152: IC4.9 20.61,59.91 20.61,59.55 22.53,57.62 29.22,57.62 R29.1
N$20
  Top 0.152: SUSPENDINV.2 23.27,66.04 26.54,62.76 R1.2
N$21
  Top 0.152: R30.2 D1.A
N$22
  Top 0.152: R31.2 D2.A
N$23
  Top 0.152: R32.2 D4.A
N$24  (via drill 0.35)
  other vias: 20.32,35.56
N$25  (via drill 0.35)
  other vias: 21.59,35.56
N$26  (via drill 0.35)
  other vias: 19.05,34.29
N$27  (via drill 0.35)
  other vias: 20.32,34.29
N$28  (via drill 0.35)
  other vias: 21.59,34.29
N$29  (via drill 0.35)
  other vias: 19.05,33.02
N$30  (via drill 0.35)
  other vias: 20.32,33.02
N$31  (via drill 0.35)
  other vias: 21.59,33.02
N$32  (via drill 0.35)
  other vias: 19.05,31.75
N$33  (via drill 0.35)
  other vias: 20.32,31.75
N$34  (via drill 0.35)
  other vias: 21.59,31.75
N$35  (via drill 0.35)
  other vias: 19.05,30.48
N$36  (via drill 0.35)
  other vias: 20.32,30.48
N$37  (via drill 0.35)
  other vias: 21.59,30.48
N$38  (via drill 0.35)
  other vias: 19.05,20.32
N$39  (via drill 0.35)
  other vias: 20.32,20.32
N$40  (via drill 0.35)
  other vias: 21.59,20.32
N$41  (via drill 0.35)
  other vias: 19.05,19.05
N$42  (via drill 0.35)
  other vias: 20.32,19.05
N$43  (via drill 0.35)
  other vias: 21.59,19.05
N$44  (via drill 0.35)
  other vias: 19.05,17.78
N$45  (via drill 0.35)
  other vias: 20.32,17.78
N$46  (via drill 0.35)
  other vias: 21.59,17.78
N$47  (via drill 0.35)
  other vias: 19.05,16.51
N$48  (via drill 0.35)
  other vias: 20.32,16.51
N$49  (via drill 0.35)
  other vias: 21.59,16.51
N$50  (via drill 0.35)
  other vias: 19.05,15.24
N$51  (via drill 0.35)
  other vias: 20.32,15.24
N$52  (via drill 0.35)
  other vias: 21.59,15.24
N$53  (via drill 0.35)
  other vias: 5.08,20.32
N$54  (via drill 0.35)
  other vias: 6.35,20.32
N$55  (via drill 0.35)
  other vias: 5.08,19.05
N$56  (via drill 0.35)
  other vias: 6.35,19.05
N$57  (via drill 0.35)
  other vias: 7.62,19.05
N$58  (via drill 0.35)
  other vias: 5.08,17.78
N$59  (via drill 0.35)
  other vias: 6.35,17.78
N$60  (via drill 0.35)
  other vias: 7.62,17.78
N$61  (via drill 0.35)
  other vias: 5.08,16.51
N$62  (via drill 0.35)
  other vias: 6.35,16.51
N$63  (via drill 0.35)
  other vias: 7.62,16.51
N$64  (via drill 0.35)
  other vias: 5.08,15.24
N$65  (via drill 0.35)
  other vias: 6.35,15.24
N$66  (via drill 0.35)
  other vias: 7.62,15.24
N$67  (via drill 0.35)
  other vias: 7.62,20.32
NCKNOP
  Top 0.152: SJ1.1 26.31,89.34 C34.2
NCROTORY
  Top 0.152: SJ2.1 55.12,78.86 C30.2
ROTORA  (via drill 0.35)
  Top 0.152: U1.6 v3.05,90.93 | MT1.A 64.73,76.78 54.81,76.78 53.97,77.62 53.97,83.62 55.14,84.8 R34.1 55.14,87.95 56.32,89.13 56.32,91.17 55.85,91.64 52.63,91.64 JP9.7
  Bottom 0.152: v3.05,90.93 10.34,98.22 46.99,98.22 49.66,95.56 JP9.7
ROTORB  (via drill 0.35)
  Top 0.152: U1.7 3.07,89.43 v3.05,89.41 | MT1.B 69.07,75.2 62.12,75.2 61.01,76.31 54.34,76.31 53.53,77.11 53.53,86.88 55.14,88.48 R35.1 54.47,90.17 53.29,91.35 50.38,91.35 JP9.8
  Bottom 0.152: v3.05,89.41 11.56,97.92 45.72,97.92 47.12,96.52 JP9.8
ROTORKNOP  (via drill 0.35)
  Top 0.152: U1.9 3.11,86.43 v3.05,86.49 | MT1.2 68.92,92.09 60.34,92.09 57.29,89.04 | JP9.9 46.48,96.52 52.54,96.52 53.34,95.72 53.34,93.42 54.75,92 56.28,92 57.29,91 57.29,89.04 | 57.29,89.04 57.29,86.22 55.14,84.08 R33.1 55.85,83.25 57.99,83.25 SJ2.2
  Bottom 0.152: v3.05,86.49 14.17,97.61 43.18,97.61 44.58,96.22 JP9.9
RTS
  Top 0.152: IC4.24 22.1,65.81 21.43,66.48 16.45,66.48 12.26,62.29 12.26,57.15 13.69,55.72 13.69,52.2 12.26,50.76 12.26,48.38 7.94,44.06 7.94,40.58 9.15,39.37 Q3.1 10.16,33.02 11.25,31.93 R18.1
RX0  (via drill 0.35)
  Top 0.152: JP7.3 71.02,98.91 27.7,98.91 25.36,96.56 25.36,95.25 22.82,92.71 v22.53,92.71 21.59,92.71 21.53,92.77 U1.38 | IC4.26 21.1,65.05 20.53,65.62 v20.31,65.62
  Bottom 0.152: v20.31,65.62 20.31,90.16 22.86,92.71 v22.53,92.71
SCL  (via drill 0.35)
  Top 0.152: U1.5 3.27,92.43 v3.17,92.33
  Bottom 0.152: v3.17,92.33 2.92,92.33 2.16,93.09 2.16,93.98 7.09,98.91 53.34,98.91 54.74,97.51 JP9.5
SDA  (via drill 0.35)
  Top 0.152: U1.4 3.12,93.93 v3.05,93.85
  Bottom 0.152: v3.05,93.85 7.72,98.53 48.28,98.53 JP9.6
SERVO1
  Top 0.152: U1.32 21.57,83.43 22.84,82.16 28.33,82.16 JP3.1 29.21,81.31 31.14,83.24 32.44,83.24 33.02,83.82 33.02,92.71 34.42,94.11 JP9.13
SERVO2
  Top 0.152: U1.33 21.57,84.93 22.84,83.66 27.78,83.66 JP4.1 29.21,86.82 30.19,87.81 30.19,92.42 31.88,94.11 JP9.14
SERVO3
  Top 0.152: U1.34 21.57,86.43 22.84,85.16 27.02,85.16 29.08,87.22 29.08,88.9 | JP6.1 29.08,88.9 | JP9.15 29.34,89.15 29.08,88.9
TX0  (via drill 0.35)
  Top 0.152: JP7.2 72.64,95.89 70.26,98.27 27.53,98.27 25.68,96.42 25.68,92.87 22.98,90.17 v22.86,90.17 21.95,90.17 U1.37 | v21.48,65.55 21.6,65.43 IC4.25
  Bottom 0.152: v21.48,65.55 22.86,66.93 v22.86,90.17
V_USB
  Top 0.152: U2.3 9.7,20.13 C24.1 9.89,20.32 8.89,20.32 5.99,23.22 5.99,40.39 3.96,42.42 3.96,50.93 2.82,52.2 2.82,56.03 4.6,57.82 4.6,61.05 | R5.2 9.95,59.78 J5.VBUS2 6.77,59.78 6.35,60.2 5.46,60.2 4.6,61.05 | 4.6,61.05 4.6,62.77 6.39,64.55 7.15,64.55 J5.VBUS1
VCC  (via drill 0.35)
  Top 0.152: 8.55,54.1 v8.64,54.1 | C7B2.1 26.32,51.44 v24.89,51.44 | C21.1 93.21,79.38 v91.95,79.38 | C20.1 37.27,63.43 v37.85,64.01 | C11.1 C17.1 C14.1 C7.1 C7B1.1 C7A1.1 | IC1.22 100.73,35.69 | IC3.28 97.6,89.15 | C7A2.1 C7A3.1 C7B3.1 C23.1 C7A1.1 | C7A1.1 48.9,64.63 v48.9,64.52 | C15.1 93.73,51.94 v92.08,51.94 | C9.1 93.82,25.23 v92.46,25.23 | 24.13,35.57 24.35,35.67 C28.1 v28.35,37.8 | 24.13,35.57 23.91,35.47 23.75,35.39 U4.3 24.13,35.57 | v29.21,22.86 C26.1 26.53,22.93 U3.3
  Top 0.406: J13.1-2 7.62,55.03 | J13.1 7.62,55.03 | 7.62,55.03 8.55,54.1 | IC1.28 97.22,35.86 v96.07,35.86 | 100.73,35.69 v102.23,35.69 | IC2.22 100.98,62.61 v101.85,62.61 | IC2.28 97.09,62.66 v96.42,62.66 | v102.23,89.15 102.15,89.24 IC3.22 | 97.6,89.15 v96.14,89.15
  pour Bottom (rank 2, no thermals): -19.05,105.41 -19.05,-5.08 138.43,-5.08 138.43,114.3 -19.05,114.3 -20.32,115.57 -20.32,106.68

### Text on the board
tNames: PWR / GROEP: ICTEO2 / 2022-2023